# Altium project coursework_larionov.PrjPcb (part 1 of 2)
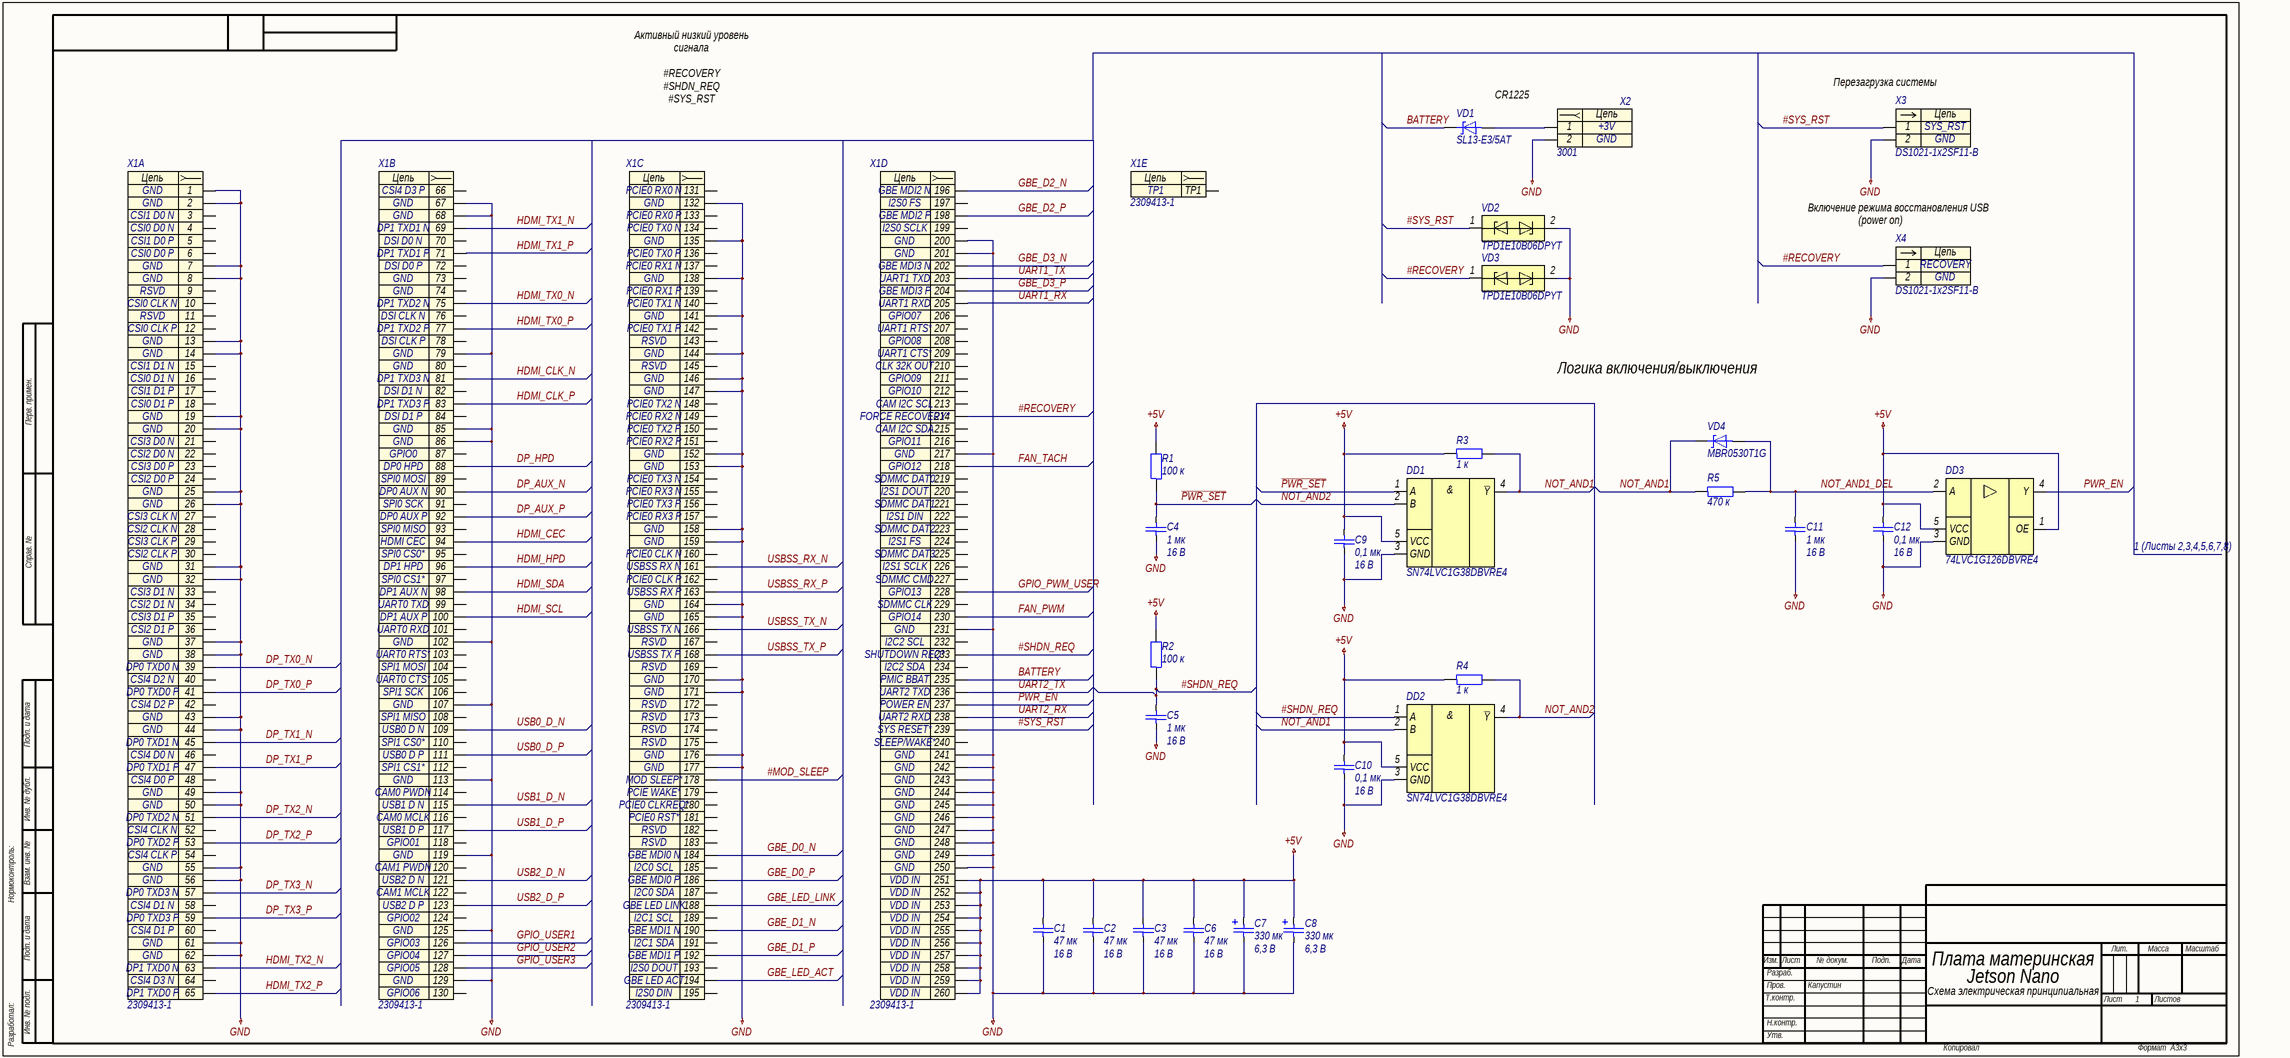
[diagram p0: 001_Jetson_Nano.SchDoc]
approver: Капустин; check: Капустин; designation: СПБПУ.3331506.016; developer: Ларионов; document_code: Ý3; document_type: Схема электрическая принципиальная; pcb_dec_number: СПБПУ.3331506.016; project: Плата материнская Jetson Nano; sheets_total: 9; title: Плата материнская Jetson Nano; title_line_1: Плата материнская; title_line_2: Jetson Nano
9 sheets, 196 parts. Net scope: global (net labels, ports and power ports of the same name join across sheets).
Sheets:
  001_Jetson_Nano.SchDoc
  002_Buck_Converter.SchDoc
  003_Serial_Port.SchDoc
  004_USB.SchDoc
  005_DP.SchDoc
  006_HDMI.SchDoc
  007_Ethernet.SchDoc
  008_Fan_GPIO_LED.SchDoc
  template_n_revision_sheet.SchDoc

## Sheet 001_Jetson_Nano.SchDoc: Плата материнская Jetson Nano
size 891 x 420 mm; ApprovedBy: Капустин; CheckedBy: Капустин; DrawnBy: Ларионов; DocumentNumber: СПБПУ.3331506.016Ý3; SheetNumber: 1; SheetTotal: 9; DocumentCode: Ý3; ImagePath: СПБПУ.3331506.016

### Parts
C1  47 мк  Напряжение: 16 В  [C1206]
C2  47 мк  Напряжение: 16 В  [C1206]
C3  47 мк  Напряжение: 16 В  [C1206]
C4  1 мк  Напряжение: 16 В  [C0603]
C5  1 мк  Напряжение: 16 В  [C0603]
C6  47 мк  Напряжение: 16 В  [C1206]
C7  330 мк  Напряжение: 6,3 В  [C7343-31]
C8  330 мк  Напряжение: 6,3 В  [C7343-31]
C9  0,1 мк  Напряжение: 16 В  [C0603]
C10  0,1 мк  Напряжение: 16 В  [C0603]
C11  1 мк  Напряжение: 16 В  [C0603]
C12  0,1 мк  Напряжение: 16 В  [C0603]
DD1  SN74LVC1G38DBVRE4  [SOT-23-5-P95-290X280X145]
DD2  SN74LVC1G38DBVRE4  [SOT-23-5-P95-290X280X145]
DD3  74LVC1G126DBVRE4  [SOT-23-5-P95-290X280X145]
R1  100 к  [R0603]
R2  100 к  [R0603]
R3  1 к  [R0603]
R4  1 к  [R0603]
R5  470 к  [R0603]
VD1  SL13-E3/5AT  [DO-214AC-510X270X229]
VD2  TPD1E10B06DPYT  [X1SON-2-100X60X45]
VD3  TPD1E10B06DPYT  [X1SON-2-100X60X45]
VD4  MBR0530T1G  [SOD-123-368X160X135]
X1  2309413-1  [2309413-1]  (parts A,B,C,D,E of 5)
X2  3001  [3001]
X3  DS1021-1x2SF11-B  [DS1021-1X2SF11-B]
X4  DS1021-1x2SF11-B  [DS1021-1X2SF11-B]

### Nets
+5V: C1.1 C2.1 C3.1 C6.1 C7.1 C8.1 C9.1 C10.1 C12.1 DD1.5(VCC) DD2.5(VCC) DD3.1(OE) DD3.5(VCC) R1.2 R2.2 R3.1 R4.1 X1.251(VDD_IN) X1.252(VDD_IN) X1.253(VDD_IN) X1.254(VDD_IN) X1.255(VDD_IN) X1.256(VDD_IN) X1.257(VDD_IN) X1.258(VDD_IN) X1.259(VDD_IN) X1.260(VDD_IN)
GND: C1.2 C2.2 C3.2 C4.2 C5.2 C6.2 C7.2 C8.2 C9.2 C10.2 C11.2 C12.2 DD1.3(GND) DD2.3(GND) DD3.3(GND) VD2.2 VD3.2 X1.1(GND) X1.2(GND) X1.7(GND) X1.8(GND) X1.13(GND) X1.14(GND) X1.19(GND) X1.20(GND) X1.25(GND) X1.26(GND) X1.31(GND) X1.32(GND) X1.37(GND) X1.38(GND) X1.43(GND) X1.44(GND) X1.49(GND) X1.50(GND) X1.55(GND) X1.56(GND) X1.61(GND) X1.62(GND) X1.67(GND) X1.68(GND) X1.79(GND) X1.85(GND) X1.86(GND) X1.102(GND) X1.107(GND) X1.113(GND) X1.119(GND) X1.125(GND) X1.129(GND) X1.132(GND) X1.135(GND) X1.138(GND) X1.141(GND) X1.144(GND) X1.146(GND) X1.147(GND) X1.152(GND) X1.153(GND) X1.158(GND) X1.159(GND) X1.164(GND) X1.165(GND) X1.170(GND) X1.171(GND) X1.176(GND) X1.177(GND) X1.200(GND) X1.201(GND) X1.217(GND) X1.231(GND) X1.241(GND) X1.242(GND) X1.243(GND) X1.244(GND) X1.245(GND) X1.246(GND) X1.247(GND) X1.248(GND) X1.249(GND) X1.250(GND) X2.2 X3.2 X4.2
#MOD_SLEEP: X1.178(MOD_SLEEP*)
#RECOVERY: VD3.1 X1.214(FORCE_RECOVERY*) X4.1
#SHDN_REQ: C5.1 DD2.1(A) R2.1 X1.233(SHUTDOWN_REQ*)
#SYS_RST: VD2.1 X1.239(SYS_RESET*) X3.1
~{PWR_SET}: C4.1 DD1.1(A) R1.1
BATTERY: VD1.1 X1.235(PMIC_BBAT)
DP_AUX_N: X1.90(DP0_AUX_N)
DP_AUX_P: X1.92(DP0_AUX_P)
DP_HPD: X1.88(DP0_HPD)
DP_TX0_N: X1.39(DP0_TXD0_N)
DP_TX0_P: X1.41(DP0_TXD0_P)
DP_TX1_N: X1.45(DP0_TXD1_N)
DP_TX1_P: X1.47(DP0_TXD1_P)
DP_TX2_N: X1.51(DP0_TXD2_N)
DP_TX2_P: X1.53(DP0_TXD2_P)
DP_TX3_N: X1.57(DP0_TXD3_N)
DP_TX3_P: X1.59(DP0_TXD3_P)
FAN_PWM: X1.230(GPIO14)
FAN_TACH: X1.218(GPIO12)
GBE_D0_N: X1.184(GBE_MDI0_N)
GBE_D0_P: X1.186(GBE_MDI0_P)
GBE_D1_N: X1.190(GBE_MDI1_N)
GBE_D1_P: X1.192(GBE_MDI1_P)
GBE_D2_N: X1.196(GBE_MDI2_N)
GBE_D2_P: X1.198(GBE_MDI2_P)
GBE_D3_N: X1.202(GBE_MDI3_N)
GBE_D3_P: X1.204(GBE_MDI3_P)
GBE_LED_ACT: X1.194(GBE_LED_ACT)
GBE_LED_LINK: X1.188(GBE_LED_LINK)
GPIO_PWM_USER: X1.228(GPIO13)
GPIO_USER1: X1.126(GPIO03)
GPIO_USER2: X1.127(GPIO04)
GPIO_USER3: X1.128(GPIO05)
HDMI_CEC: X1.94(HDMI_CEC)
HDMI_CLK_N: X1.81(DP1_TXD3_N)
HDMI_CLK_P: X1.83(DP1_TXD3_P)
HDMI_HPD: X1.96(DP1_HPD)
HDMI_SCL: X1.100(DP1_AUX_P)
HDMI_SDA: X1.98(DP1_AUX_N)
HDMI_TX0_N: X1.75(DP1_TXD2_N)
HDMI_TX0_P: X1.77(DP1_TXD2_P)
HDMI_TX1_N: X1.69(DP1_TXD1_N)
HDMI_TX1_P: X1.71(DP1_TXD1_P)
HDMI_TX2_N: X1.63(DP1_TXD0_N)
HDMI_TX2_P: X1.65(DP1_TXD0_P)
NOT_AND1: DD1.4(~{Y}) DD2.2(B) R3.2 R5.1 VD4.1
NOT_AND1_DEL: C11.1 DD3.2(A) R5.2 VD4.2
NOT_AND2: DD1.2(B) DD2.4(~{Y}) R4.2
PWR_EN: DD3.4(Y) X1.237(POWER_EN)
UART1_RX: X1.205(UART1_RXD)
UART1_TX: X1.203(UART1_TXD)
UART2_RX: X1.238(UART2_RXD)
UART2_TX: X1.236(UART2_TXD)
USB0_D_N: X1.109(USB0_D_N)
USB0_D_P: X1.111(USB0_D_P)
USB1_D_N: X1.115(USB1_D_N)
USB1_D_P: X1.117(USB1_D_P)
USB2_D_N: X1.121(USB2_D_N)
USB2_D_P: X1.123(USB2_D_P)
USBSS_RX_N: X1.161(USBSS_RX_N)
USBSS_RX_P: X1.163(USBSS_RX_P)
USBSS_TX_N: X1.166(USBSS_TX_N)
USBSS_TX_P: X1.168(USBSS_TX_P)
NetVD1_2: VD1.2 X2.1

Not connected (* = marked no-connect by the designer): X1 3(CSI1_D0_N) 4(CSI0_D0_N) 5(CSI1_D0_P) 6(CSI0_D0_P) 9(RSVD) 10(CSI0_CLK_N) 11(RSVD) 12(CSI0_CLK_P) 15(CSI1_D1_N) 16(CSI0_D1_N) 17(CSI1_D1_P) 18(CSI0_D1_P) 21(CSI3_D0_N) 22(CSI2_D0_N) 23(CSI3_D0_P) 24(CSI2_D0_P) 27(CSI3_CLK_N) 28(CSI2_CLK_N) 29(CSI3_CLK_P) 30(CSI2_CLK_P) 33(CSI3_D1_N) 34(CSI2_D1_N) 35(CSI3_D1_P) 36(CSI2_D1_P) 40(CSI4_D2_N) 42(CSI4_D2_P) 46(CSI4_D0_N) 48(CSI4_D0_P) 52(CSI4_CLK_N) 54(CSI4_CLK_P) 58(CSI4_D1_N) 60(CSI4_D1_P) 64(CSI4_D3_N) 66(CSI4_D3_P) 70(DSI_D0_N) 72(DSI_D0_P) 73(GND) 74(GND) 76(DSI_CLK_N) 78(DSI_CLK_P) 80(GND) 82(DSI_D1_N) 84(DSI_D1_P) 87(GPIO0) 89(SPI0_MOSI) 91(SPI0_SCK) 93(SPI0_MISO) 95(SPI0_CS0*) 97(SPI0_CS1*) 99(UART0_TXD) 101(UART0_RXD) 103(UART0_RTS*) 104(SPI1_MOSI) 105(UART0_CTS*) 106(SPI1_SCK) 108(SPI1_MISO) 110(SPI1_CS0*) 112(SPI1_CS1*) 114(CAM0_PWDN) 116(CAM0_MCLK) 118(GPIO01) 120(CAM1_PWDN) 122(CAM1_MCLK) 124(GPIO02) 130(GPIO06) 131(PCIE0_RX0_N) 133(PCIE0_RX0_P) 134(PCIE0_TX0_N) 136(PCIE0_TX0_P) 137(PCIE0_RX1_N) 139(PCIE0_RX1_P) 140(PCIE0_TX1_N) 142(PCIE0_TX1_P) 143(RSVD) 145(RSVD) 148(PCIE0_TX2_N) 149(PCIE0_RX2_N) 150(PCIE0_TX2_P) 151(PCIE0_RX2_P) 154(PCIE0_TX3_N) 155(PCIE0_RX3_N) 156(PCIE0_TX3_P) 157(PCIE0_RX3_P) 160(PCIE0_CLK_N) 162(PCIE0_CLK_P) 167(RSVD) 169(RSVD) 172(RSVD) 173(RSVD) 174(RSVD) 175(RSVD) 179(PCIE_WAKE*) 180(PCIE0_CLKREQ*) 181(PCIE0_RST*) 182(RSVD) 183(RSVD) 185(I2C0_SCL) 187(I2C0_SDA) 189(I2C1_SCL) 191(I2C1_SDA) 193(I2S0_DOUT) 195(I2S0_DIN) 197(I2S0_FS) 199(I2S0_SCLK) 206(GPIO07) 207(UART1_RTS*) 208(GPIO08) 209(UART1_CTS*) 210(CLK_32K_OUT) 211(GPIO09) 212(GPIO10) 213(CAM_I2C_SCL) 215(CAM_I2C_SDA) 216(GPIO11) 219(SDMMC_DAT0) 220(I2S1_DOUT) 221(SDMMC_DAT1) 222(I2S1_DIN) 223(SDMMC_DAT2) 224(I2S1_FS) 225(SDMMC_DAT3) 226(I2S1_SCLK) 227(SDMMC_CMD) 229(SDMMC_CLK) 232(I2C2_SCL) 234(I2C2_SDA) 240(SLEEP/WAKE*) TP1

### Notes on the sheet
- Активный низкий уровень сигнала
  #RECOVERY
  #SHDN_REQ
  #SYS_RST
  #MOD_SLEEP
- CR1225
- Перезагрузка системы
- Включение режима восстановления USB
- (power on)
- Логика включения/выключения
- 1 (Листы 2,3,4,5,6,7,8)
- Перв. примен.
- Справ. №
- Подп. и дата
- Инв. № дубл.
- Нормоконтроль:
- Взам. инв. №
- Изм.
- Лист
- № докум.
- Подп.
- Дата
- Лит.
- Масса
- Масштаб
- Т.контр.
- Пров.
- Разраб.
- Листов
- Разработал:
- Инв. № подл.
- Н.контр.
- Утв.
- Копировал
- Формат
- А3х3
- (in symbol dd0001) &
- (in symbol x0017, part A) Цепь
- (in symbol x0017, part B) Цепь
- (in symbol x0017, part C) Цепь
- (in symbol x0017, part D) Цепь
- (in symbol x0017, part E) Цепь
- (in symbol x0025) Цепь
- (in symbol x0058) Цепь

### Library data of the parts
C1-C3 C6 = c0168: =Описание; ID: c0168; Фамилия: Паньков; Описание: Конденсатор керамический чип 1206 47 мкФ 16 В ±20 %; Наименование: CC1206MKX5R7BB476; Производитель: YAGEO Corp.; Отклонение: ±20 %; Рабочие температуры: от –55 °С до +85 °С; Температурный коэффициент емкости: X5R; Корпус: 1206; Номинал: 47 мк; Номинальное напряжение: 16 В; HelpURL: https://www.yageo.com/upload/media/product/productsearch/datasheet/mlcc/UPY-GPHC_X5R_4V-to-50V_26.pdf
C4 C5 C11 = c0113: =Описание; ID: c0113; Фамилия: Паньков; Описание: Конденсатор керамический чип 0603 1 мкФ 16 В ±10 %; Наименование: CC0603KRX7R7BB105; Производитель: YAGEO Corp.; Отклонение: ±10 %; Рабочие температуры: от –55 °С до +125 °С; Температурный коэффициент емкости: X7R; Корпус: 0603; Номинал: 1 мк; Номинальное напряжение: 16 В; HelpURL: https://www.yageo.com/upload/media/product/productsearch/datasheet/mlcc/UPY-GPHC_X7R_6.3V-to-50V_20.pdf
C7 C8 = c0173: =Описание; ID: c0173; Фамилия: Ларионов; Описание: Конденсатор электролитический чип 7343-31 330 мкФ 6,3 В ±20 %; Наименование: ECASD60J337M009KA0; Производитель: Murata Manufacturing Co., Ltd.; Отклонение: ±20 %; Эквивалентное последовательное сопротивление: 0,009 Ом; Среднеквадратичный размах пульсации тока: 3,5 А; Рабочие температуры: от –40 °С до +105 °С; Корпус: 7343-31; Номинал: 330 мк; Номинальное напряжение: 6,3 В; HelpURL: https://www.murata.com/en-us/products/productdetail?partno=ECASD60J337M009KA0
C9 C10 C12 = c0081: =Описание; ID: c0081; Фамилия: Паньков; Описание: Конденсатор керамический чип 0603 100 нФ 16 В ±10 %; Наименование: CC0603KRX7R7BB104; Производитель: YAGEO Corp.; Отклонение: ±10 %; Рабочие температуры: от –55 °С до +125 °С; Температурный коэффициент емкости: X7R; Корпус: 0603; Номинал: 0,1 мк; Номинальное напряжение: 16 В; HelpURL: https://www.yageo.com/upload/media/product/productsearch/datasheet/mlcc/UPY-GPHC_X7R_6.3V-to-50V_20.pdf
DD1 DD2 = dd0001: =Описание; ID: dd0001; Фамилия: Ларионов; Описание: Логический элемент И-НЕ 2 входа 1 выход; Производитель: Texas Instruments Inc.; Корпус: SOT-23-5; Наименование: SN74LVC1G38DBVRE4; HelpURL: https://www.ti.com/product/SN74LVC1G38
DD3 = dd0001: =Описание; ID: dd0001; Фамилия: Ларионов; Описание: Буферная микросхема 1 линия 3 состояния выхода; Производитель: Texas Instruments Inc.; Корпус: SOT-23-5; Наименование: 74LVC1G126DBVRE4; HelpURL: https://www.ti.com/product/SN74LVC1G126
R1 R2 = r0141: =Описание; ID: r0141; Фамилия: Водорезов; Описание: Резистор чип 0603 100 кОм ±1 % 0,1 Вт; Наименование: RC0603FR-07100KL; Производитель: YAGEO Corp.; Отклонение: ±1 %; Номинальное напряжение: 75 В; Номинальный ток: 1 А; Рабочие температуры: от –55 °С до +155 °С; Корпус: 0603; Примечание: Ряд E24; Номинал: 100 к; HelpURL: https://www.yageo.com/upload/media/product/productsearch/datasheet/rchip/PYu-RC_Group_51_RoHS_L_11.pdf
R3 R4 = r0076: =Описание; ID: r0076; Фамилия: Ларионов; Описание: Резистор чип 0603 1 кОм ±1 % 0,1 Вт; Наименование: RC0603FR-071KL; Производитель: YAGEO Corp.; Отклонение: ±1 %; Номинальное напряжение: 75 В; Номинальный ток: 1 А; Рабочие температуры: от –55 °С до +155 °С; Корпус: 0603; Примечание: Ряд E24; Номинал: 1 к; HelpURL: https://www.yageo.com/upload/media/product/productsearch/datasheet/rchip/PYu-RC_Group_51_RoHS_L_11.pdf
R5 = r0164: =Описание; ID: r0164; Фамилия: Паньков; Описание: Резистор чип 0603 470 кОм ±1 % 0,1 Вт; Наименование: RC0603FR-07470KL; Производитель: YAGEO Corp.; Отклонение: ±1 %; Номинальное напряжение: 75 В; Номинальный ток: 1 А; Рабочие температуры: от –55 °С до +155 °С; Корпус: 0603; Примечание: Ряд E24; Номинал: 470 к; HelpURL: https://www.yageo.com/upload/media/product/productsearch/datasheet/rchip/PYu-RC_Group_51_RoHS_L_11.pdf
VD1 = vd0003: =Описание; ID: vd0003; Фамилия: Ларионов; Описание: Диод Шоттки 30 В 1,5 А; Производитель: Vishay Intertechnology, Inc.; Максимальное прямое напряжение: 0,445 В; Максимальное обратное напряжение: 30 В; Максимальный прямой ток: 1,5 А; Рабочие температуры: от –55 °С до +125 °С; Корпус: DO-214AC; Наименование: SL13-E3/5AT; HelpURL: https://www.vishay.com/product?docid=88740
VD2 VD3 = vd0013: =Описание; ID: vd0013; Фамилия: Ларионов; Описание: Двунаправленная диодная сборка для подавления помех 5,5 В; Производитель: Texas Instruments Inc.; Корпус: X1SON-2; Наименование: TPD1E10B06DPYT; HelpURL: https://www.ti.com/product/TPD1E10B06
VD4 = vd0001: =Описание; ID: vd0001; Фамилия: Шкабара; Описание: Диод Шоттки 30 В 0,5 А; Производитель: ON Semiconductor; Максимальное прямое напряжение: 0,43 В; Максимальное обратное напряжение: 30 В; Максимальный прямой ток: 0,5 А; Рабочие температуры: от –65 °С до +125 °С; Корпус: SOD-123; Наименование: MBR0530T1G; HelpURL: https://www.onsemi.com/products/discretes-drivers/diodes-rectifiers/schottky-diodes-schottky-rectifiers/mbr0530t1g
X1 = x0017: =Описание; Contact_001: GND; Contact_003: CSI1 D0 N; Contact_004: CSI0 D0 N; Contact_005: CSI1 D0 P; Contact_006: CSI0 D0 P; Contact_010: CSI0 CLK N; Contact_011: RSVD; Contact_012: CSI0 CLK P; Contact_015: CSI1 D1 N; Contact_016: CSI0 D1 N; Contact_017: CSI1 D1 P; Contact_030: CSI2 CLK P; Contact_036: CSI2 D1 P; Contact_039: DP0 TXD0 N; Contact_040: CSI4 D2 N; Contact_018: CSI0 D1 P; Contact_021: CSI3 D0 N; Contact_022: CSI2 D0 N; Contact_023: CSI3 D0 P; Contact_024: CSI2 D0 P; Contact_027: CSI3 CLK N; Contact_028: CSI2 CLK N; Contact_029: CSI3 CLK P; Contact_033: CSI3 D1 N; Contact_034: CSI2 D1 N; Contact_035: CSI3 D1 P; Contact_041: DP0 TXD0 P; Contact_052: CSI4 CLK N; Contact_063: DP1 TXD0 N; Contact_069: DP1 TXD1 N; Contact_070: DSI D0 N; Contact_071: DP1 TXD1 P; Contact_072: DSI D0 P; Contact_042: CSI4 D2 P; Contact_045: DP0 TXD1 N; Contact_046: CSI4 D0 N; Contact_047: DP0 TXD1 P; Contact_048: CSI4 D0 P; Contact_051: DP0 TXD2 N; Contact_053: DP0 TXD2 P; Contact_054: CSI4 CLK P; Contact_057: DP0 TXD3 N; Contact_058: CSI4 D1 N; Contact_059: DP0 TXD3 P; Contact_060: CSI4 D1 P; Contact_064: CSI4 D3 N; Contact_065: DP1 TXD0 P; Contact_066: CSI4 D3 P; Contact_075: DP1 TXD2 N; Contact_076: DSI CLK N; Contact_077: DP1 TXD2 P; Contact_078: DSI CLK P; Contact_081: DP1 TXD3 N; Contact_082: DSI D1 N; Contact_083: DP1 TXD3 P; Contact_084: DSI D1 P; Contact_087: GPIO0; Contact_088: DP0 HPD; Contact_089: SPI0 MOSI; Contact_090: DP0 AUX N; Contact_091: SPI0 SCK; Contact_092: DP0 AUX P; Contact_093: SPI0 MISO; Contact_094: HDMI CEC; Contact_095: SPI0 CS0*; Contact_096: DP1 HPD; Contact_097: SPI0 CS1*; Contact_098: DP1 AUX N; Contact_099: UART0 TXD; Contact_100: DP1 AUX P; Contact_101: UART0 RXD; Contact_103: UART0 RTS*; Contact_104: SPI1 MOSI; Contact_105: UART0 CTS*; Contact_106: SPI1 SCK; Contact_108: SPI1 MISO; Contact_109: USB0 D N; Contact_110: SPI1 CS0*; Contact_111: USB0 D P; Contact_112: SPI1 CS1*; Contact_114: CAM0 PWDN; Contact_115: USB1 D N; Contact_116: CAM0 MCLK; Contact_117: USB1 D P; Contact_118: GPIO01; Contact_120: CAM1 PWDN; Contact_121: USB2 D N; Contact_122: CAM1 MCLK; Contact_123: USB2 D P; Contact_124: GPIO02; Contact_126: GPIO03; Contact_127: GPIO04; Contact_128: GPIO05; Contact_130: GPIO06; Contact_131: PCIE0 RX0 N; Contact_133: PCIE0 RX0 P; Contact_134: PCIE0 TX0 N; Contact_136: PCIE0 TX0 P; Contact_137: PCIE0 RX1 N; Contact_139: PCIE0 RX1 P; Contact_140: PCIE0 TX1 N; Contact_142: PCIE0 TX1 P; Contact_148: PCIE0 TX2 N; Contact_149: PCIE0 RX2 N; Contact_150: PCIE0 TX2 P; Contact_151: PCIE0 RX2 P; Contact_154: PCIE0 TX3 N; Contact_155: PCIE0 RX3 N; Contact_156: PCIE0 TX3 P; Contact_157: PCIE0 RX3 P; Contact_160: PCIE0 CLK N; Contact_161: USBSS RX N; Contact_162: PCIE0 CLK P; Contact_163: USBSS RX P; Contact_166: USBSS TX N; Contact_168: USBSS TX P; Contact_178: MOD SLEEP*; Contact_179: PCIE WAKE*; Contact_180: PCIE0 CLKREQ*; Contact_181: PCIE0 RST*; Contact_184: GBE MDI0 N; Contact_185: I2C0 SCL; Contact_186: GBE MDI0 P; Contact_187: I2C0 SDA; Contact_188: GBE LED LINK; Contact_189: I2C1 SCL; Contact_190: GBE MDI1 N; Contact_191: I2C1 SDA; Contact_192: GBE MDI1 P; Contact_193: I2S0 DOUT; Contact_194: GBE LED ACT; Contact_195: I2S0 DIN; Contact_196: GBE MDI2 N; Contact_197: I2S0 FS; Contact_198: GBE MDI2 P; Contact_199: I2S0 SCLK; Contact_202: GBE MDI3 N; Contact_203: UART1 TXD; Contact_204: GBE MDI3 P; Contact_205: UART1 RXD; Contact_206: GPIO07; Contact_207: UART1 RTS*; Contact_208: GPIO08; Contact_209: UART1 CTS*; Contact_210: CLK 32K OUT; Contact_211: GPIO09; Contact_212: GPIO10; Contact_213: CAM I2C SCL; Contact_214: FORCE RECOVERY*; Contact_215: CAM I2C SDA; Contact_216: GPIO11; Contact_218: GPIO12; Contact_219: SDMMC DAT0; Contact_220: I2S1 DOUT; Contact_221: SDMMC DAT1; Contact_222: I2S1 DIN; Contact_223: SDMMC DAT2; Contact_224: I2S1 FS; Contact_225: SDMMC DAT3; Contact_226: I2S1 SCLK; Contact_227: SDMMC CMD; Contact_228: GPIO13; Contact_229: SDMMC CLK; Contact_230: GPIO14; Contact_232: I2C2 SCL; Contact_233: SHUTDOWN REQ*; Contact_234: I2C2 SDA; Contact_235: PMIC BBAT; Contact_236: UART2 TXD; Contact_237: POWER EN; Contact_238: UART2 RXD; Contact_239: SYS RESET*; Contact_240: SLEEP/WAKE*; Contact_251: VDD IN; ID: x0017; Фамилия: Ларионов; Описание: SO DIMM 260 pin высота 9,2 мм гнездо угловой; Производитель: TE Connectivity; Contact_002: GND; Contact_007: GND; Contact_008: GND; Contact_013: GND; Contact_014: GND; Contact_009: RSVD; Contact_019: GND; Contact_037: GND; Contact_038: GND; Contact_020: GND; Contact_025: GND; Contact_026: GND; Contact_031: GND; Contact_032: GND; Contact_067: GND; Contact_068: GND; Contact_043: GND; Contact_044: GND; Contact_049: GND; Contact_050: GND; Contact_055: GND; Contact_056: GND; Contact_061: GND; Contact_062: GND; Contact_073: GND; Contact_074: GND; Contact_079: GND; Contact_080: GND; Contact_085: GND; Contact_086: GND; Contact_102: GND; Contact_107: GND; Contact_113: GND; Contact_119: GND; Contact_125: GND; Contact_129: GND; Contact_132: GND; Contact_135: GND; Contact_138: GND; Contact_141: GND; Contact_143: RSVD; Contact_144: GND; Contact_145: RSVD; Contact_146: GND; Contact_147: GND; Contact_152: GND; Contact_153: GND; Contact_158: GND; Contact_159: GND; Contact_164: GND; Contact_165: GND; Contact_167: RSVD; Contact_169: RSVD; Contact_170: GND; Contact_171: GND; Contact_172: RSVD; Contact_173: RSVD; Contact_174: RSVD; Contact_175: RSVD; Contact_176: GND; Contact_177: GND; Contact_182: RSVD; Contact_183: RSVD; Contact_200: GND; Contact_201: GND; Contact_217: GND; Contact_231: GND; Contact_241: GND; Contact_242: GND; Contact_243: GND; Contact_244: GND; Contact_245: GND; Contact_246: GND; Contact_247: GND; Contact_248: GND; Contact_249: GND; Contact_250: GND; Contact_252: VDD IN; Contact_253: VDD IN; Contact_254: VDD IN; Contact_255: VDD IN; Contact_256: VDD IN; Contact_257: VDD IN; Contact_258: VDD IN; Contact_259: VDD IN; Contact_260: VDD IN; TP1: TP1; Наименование: 2309413-1; HelpURL: https://www.te.com/usa-en/product-2309413-1.html
X2 = x0058: =Описание; Contact_1: +3V; Contact_2: GND; ID: x0058; Фамилия: Ларионов; Описание: Battery Holder CR1225 2 pin гнездо; Производитель: Keystone Electronics Corp.; Наименование: 3001; HelpURL: https://www.keyelco.com/product.cfm/product_id/778
X3 = x0025: =Описание; Contact_1: SYS_RST; Contact_2: GND; ID: x0025; Фамилия: Паньков; Описание: PLS 2 pin 2,54 мм вилка прямой; Производитель: Connfly Electronic Co., Ltd.; Наименование: DS1021-1x2SF11-B; HelpURL: http://en.connfly.group/product/xVkr=EusQssAN0gN=Aos=mU+UrVkR9kqEAN0gN9g+WqANB+A
X4 = x0025: =Описание; Contact_1: RECOVERY; Contact_2: GND; ID: x0025; Фамилия: Паньков; Описание: PLS 2 pin 2,54 мм вилка прямой; Производитель: Connfly Electronic Co., Ltd.; Наименование: DS1021-1x2SF11-B; HelpURL: http://en.connfly.group/product/xVkr=EusQssAN0gN=Aos=mU+UrVkR9kqEAN0gN9g+WqANB+A

## Sheet 002_Buck_Converter.SchDoc: Плата материнская Jetson Nano
size 594 x 420 mm; ApprovedBy: Капустин; CheckedBy: Капустин; DrawnBy: Ларионов; DocumentNumber: СПБПУ.3331506.016Ý3; SheetNumber: 2; SheetTotal: 9; DocumentCode: Ý3; ImagePath: СПБПУ.3331506.016
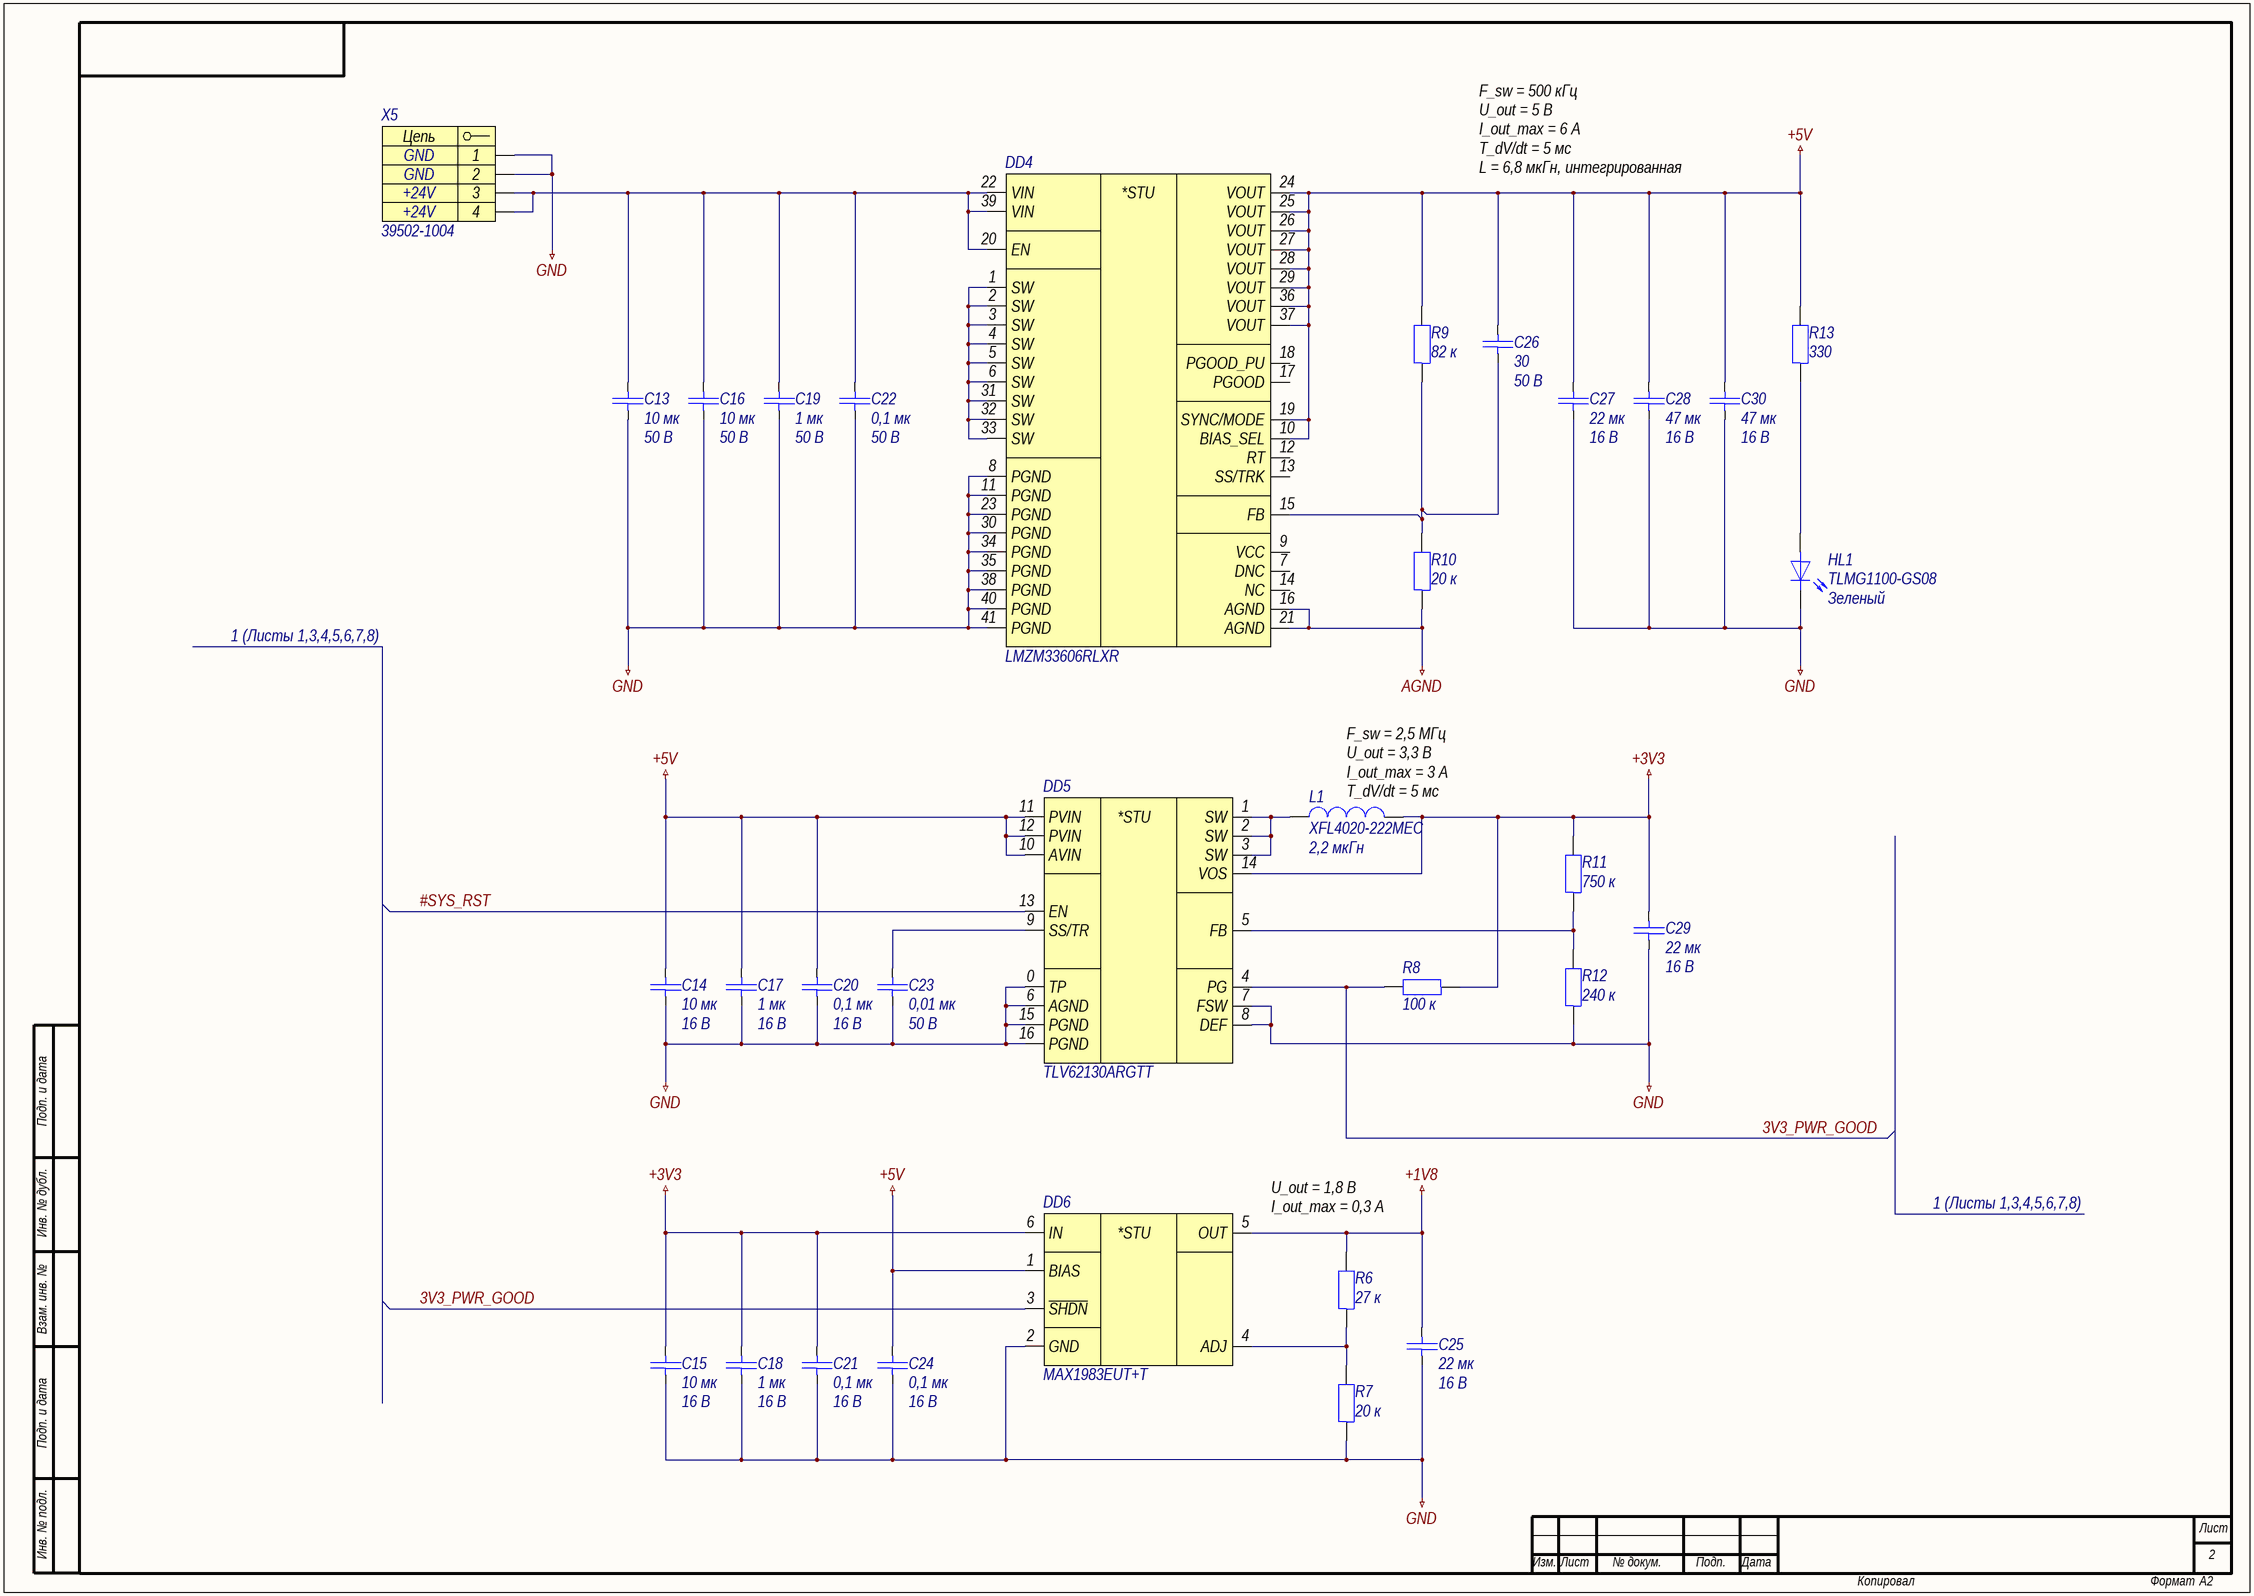
[diagram p1: 002_Buck_Converter.SchDoc]

### Parts
C13  10 мк  Напряжение: 50 В  [C0805]
C14  10 мк  Напряжение: 16 В  [C0603]
C15  10 мк  Напряжение: 16 В  [C0603]
C16  10 мк  Напряжение: 50 В  [C0805]
C17  1 мк  Напряжение: 16 В  [C0603]
C18  1 мк  Напряжение: 16 В  [C0603]
C19  1 мк  Напряжение: 50 В  [C0603]
C20  0,1 мк  Напряжение: 16 В  [C0603]
C21  0,1 мк  Напряжение: 16 В  [C0603]
C22  0,1 мк  Напряжение: 50 В  [C0603]
C23  0,01 мк  Напряжение: 50 В  [C0603]
C24  0,1 мк  Напряжение: 16 В  [C0603]
C25  22 мк  Напряжение: 16 В  [C0805]
C26  30  Напряжение: 50 В  [C0603]
C27  22 мк  Напряжение: 16 В  [C0805]
C28  47 мк  Напряжение: 16 В  [C1206]
C29  22 мк  Напряжение: 16 В  [C0805]
C30  47 мк  Напряжение: 16 В  [C1206]
DD4  LMZM33606RLXR  [B2QFN-41-1600X1000X410]
DD5  TLV62130ARGTT  [WQFN-16-P50-300X300X100-L40X24-T168X168]
DD6  MAX1983EUT+T  [SOT-23-6-P95-290X280X145]
HL1  TLMG1100-GS08  Цвет: Зеленый  [HL0603]
L1  XFL4020-222MEC  Индуктивность: 2,2 мкГн  [XFL-2-400X400X210]
R6  27 к  [R0603]
R7  20 к  [R0603]
R8  100 к  [R0603]
R9  82 к  [R0603]
R10  20 к  [R0603]
R11  750 к  [R0603]
R12  240 к  [R0603]
R13  330  [R0603]
X5  39502-1004  [39502-1004]

### Nets
+1V8: C25.1 DD6.5(OUT) R6.2
+3V3: C15.1 C18.1 C21.1 C29.1 DD5.14(VOS) DD6.6(IN) L1.2 R8.1 R11.2
+5V: C14.1 C17.1 C20.1 C24.1 C26.1 C27.1 C28.1 C30.1 DD4.10(BIAS_SEL) DD4.19(SYNC/MODE) DD4.24(VOUT) DD4.25(VOUT) DD4.26(VOUT) DD4.27(VOUT) DD4.28(VOUT) DD4.29(VOUT) DD4.36(VOUT) DD4.37(VOUT) DD5.10(AVIN) DD5.11(PVIN) DD5.12(PVIN) DD6.1(BIAS) R9.2 R13.2
AGND: DD4.16(AGND) DD4.21(AGND) R10.1
GND: C13.2 C14.2 C15.2 C16.2 C17.2 C18.2 C19.2 C20.2 C21.2 C22.2 C23.2 C24.2 C25.2 C27.2 C28.2 C29.2 C30.2 DD4.8(PGND) DD4.11(PGND) DD4.23(PGND) DD4.30(PGND) DD4.34(PGND) DD4.35(PGND) DD4.38(PGND) DD4.40(PGND) DD4.41(PGND) DD5.0(TP) DD5.6(AGND) DD5.7(FSW) DD5.8(DEF) DD5.15(PGND) DD5.16(PGND) DD6.2(GND) HL1.1 R7.1 R12.1 X5.1 X5.2
3V3_PWR_GOOD: DD5.4(PG) DD6.3(~{SHDN}) R8.2
#SYS_RST: DD5.13(EN)
NetC13_1: C13.1 C16.1 C19.1 C22.1 DD4.20(EN) DD4.22(VIN) DD4.39(VIN) X5.3 X5.4
NetC23_1: C23.1 DD5.9(SS/TR)
NetC26_2: C26.2 DD4.15(FB) R9.1 R10.2
NetDD4_1: DD4.1(SW) DD4.2(SW) DD4.3(SW) DD4.4(SW) DD4.5(SW) DD4.6(SW) DD4.31(SW) DD4.32(SW) DD4.33(SW)
NetDD5_1: DD5.1(SW) DD5.2(SW) DD5.3(SW) L1.1
NetDD5_5: DD5.5(FB) R11.1 R12.2
NetDD6_4: DD6.4(ADJ) R6.1 R7.2
NetHL1_2: HL1.2 R13.1

Not connected (* = marked no-connect by the designer): DD4 7(DNC) 9(VCC) 12(RT) 13(SS/TRK) 14(NC) 17(PGOOD) 18(PGOOD_PU)

### Notes on the sheet
- F_sw = 500 кГц
  U_out = 5 В
  I_out_max = 6 А
  T_dV/dt = 5 мс
  L = 6,8 мкГн, интегрированная
- 1 (Листы 1,3,4,5,6,7,8)
- (near L1) F_sw = 2,5 МГц
  U_out = 3,3 В
  I_out_max = 3 А
  T_dV/dt = 5 мс
- U_out = 1,8 В
  I_out_max = 0,3 А
- Подп. и дата
- Инв. № дубл.
- Взам. инв. №
- Инв. № подл.
- Лист
- Изм.
- № докум.
- Подп.
- Дата
- Копировал
- Формат
- А2
- (in symbol dd0001) *STU
- (in symbol dd0016) *STU
- (in symbol dd0017) *STU
- (in symbol x0051) Цепь

### Library data of the parts
C13 C16 = c0149: =Описание; ID: c0149; Фамилия: Паньков; Описание: Конденсатор керамический чип 0805 10 мкФ 50 В ±10 %; Наименование: CC0805KKX5R9BB106; Производитель: YAGEO Corp.; Отклонение: ±10 %; Рабочие температуры: от –55 °С до +85 °С; Температурный коэффициент емкости: X5R; Корпус: 0805; Номинал: 10 мк; Номинальное напряжение: 50 В; HelpURL: https://www.yageo.com/upload/media/product/productsearch/datasheet/mlcc/UPY-GPHC_X5R_4V-to-50V_26.pdf
C14 C15 = c0145: =Описание; ID: c0145; Фамилия: Паньков; Описание: Конденсатор керамический чип 0603 10 мкФ 16 В ±10 %; Наименование: CC0603KRX5R7BB106; Производитель: YAGEO Corp.; Отклонение: ±10 %; Рабочие температуры: от –55 °С до +85 °С; Температурный коэффициент емкости: X5R; Корпус: 0603; Номинал: 10 мк; Номинальное напряжение: 16 В; HelpURL: https://www.yageo.com/upload/media/product/productsearch/datasheet/mlcc/UPY-GPHC_X5R_4V-to-50V_26.pdf
C17 C18 = c0113: as C4 on sheet 001_Jetson_Nano; Номинал: 1 мк; Номинальное напряжение: 16 В; HelpURL: https://www.yageo.com/upload/media/product/productsearch/datasheet/mlcc/UPY-GPHC_X7R_6.3V-to-50V_20.pdf
C19 = c0117: =Описание; ID: c0117; Фамилия: Паньков; Описание: Конденсатор керамический чип 0603 1 мкФ 50 В ±10 %; Наименование: CC0603KRX7R9BB105; Производитель: YAGEO Corp.; Отклонение: ±10 %; Рабочие температуры: от –55 °С до +125 °С; Температурный коэффициент емкости: X7R; Корпус: 0603; Номинал: 1 мк; Номинальное напряжение: 50 В; HelpURL: https://www.yageo.com/upload/media/product/productsearch/datasheet/mlcc/UPY-GPHC_X7R_6.3V-to-50V_20.pdf
C20 C21 C24 = c0081: as C9 on sheet 001_Jetson_Nano; Номинал: 0,1 мк; Номинальное напряжение: 16 В; HelpURL: https://www.yageo.com/upload/media/product/productsearch/datasheet/mlcc/UPY-GPHC_X7R_6.3V-to-50V_20.pdf
C22 = c0086: =Описание; ID: c0086; Фамилия: Паньков; Описание: Конденсатор керамический чип 0603 100 нФ 50 В ±10 %; Наименование: CC0603KRX7R9BB104; Производитель: YAGEO Corp.; Отклонение: ±10 %; Рабочие температуры: от –55 °С до +125 °С; Температурный коэффициент емкости: X7R; Корпус: 0603; Номинал: 0,1 мк; Номинальное напряжение: 50 В; HelpURL: https://www.yageo.com/upload/media/product/productsearch/datasheet/mlcc/UPY-GPHC_X7R_6.3V-to-50V_20.pdf
C23 = c0056: =Описание; ID: c0056; Фамилия: Паньков; Описание: Конденсатор керамический чип 0603 10 нФ 50 В ±10 %; Наименование: CC0603KRX7R9BB103; Производитель: YAGEO Corp.; Отклонение: ±10 %; Рабочие температуры: от –55 °С до +125 °С; Температурный коэффициент емкости: X7R; Корпус: 0603; Номинал: 0,01 мк; Номинальное напряжение: 50 В; HelpURL: https://www.yageo.com/upload/media/product/productsearch/datasheet/mlcc/UPY-GPHC_X7R_6.3V-to-50V_20.pdf
C25 C27 C29 = c0159: =Описание; ID: c0159; Фамилия: Паньков; Описание: Конденсатор керамический чип 0805 22 мкФ 16 В ±20 %; Наименование: CC0805MRX5R7BB226; Производитель: YAGEO Corp.; Отклонение: ±20 %; Рабочие температуры: от –55 °С до +85 °С; Температурный коэффициент емкости: X5R; Корпус: 0805; Номинал: 22 мк; Номинальное напряжение: 16 В; HelpURL: https://www.yageo.com/upload/media/product/productsearch/datasheet/mlcc/UPY-GPHC_X5R_4V-to-50V_26.pdf
C26 = c0022: =Описание; ID: c0022; Фамилия: Ларионов; Описание: Конденсатор керамический чип 0603 30 пФ 50 В ±5 %; Наименование: CC0603JRNPO9BN300; Производитель: YAGEO Corp.; Отклонение: ±5 %; Рабочие температуры: от –55 °С до +125 °С; Температурный коэффициент емкости: C0G; Корпус: 0603; Номинал: 30; Номинальное напряжение: 50 В; HelpURL: https://www.yageo.com/upload/media/product/productsearch/datasheet/mlcc/UPY-GP_NP0_16V-to-50V_18.pdf
C28 C30 = c0168: as C1 on sheet 001_Jetson_Nano; Номинал: 47 мк; Номинальное напряжение: 16 В; HelpURL: https://www.yageo.com/upload/media/product/productsearch/datasheet/mlcc/UPY-GPHC_X5R_4V-to-50V_26.pdf
DD4 = dd0016: =Описание; ID: dd0016; Фамилия: Ларионов; Описание: Понижающий преобразователь напряжения 3,5…36 В / 1,0…20 В и 6 А; Производитель: Texas Instruments Inc.; Входное напряжение: от 3,5 В до 36 В; Выходное напряжение: от 1,0 В до 20 В; Коммутируемый ток: до 6,0 А; Частота переключения: от 350 кГц до 2,2 МГц; Рабочие температуры: от –40 °С до +125 °С; Корпус: B2QFN-41; Наименование: LMZM33606RLXR; HelpURL: https://www.ti.com/product/LMZM33606
DD5 = dd0017: =Описание; ID: dd0017; Фамилия: Самарин; Описание: Понижающий преобразователь напряжения 3,0…17 В / 0,9…5,25 В и 3,0 А; Производитель: Texas Instruments Inc.; Входное напряжение: от 3,0 В до 17 В; Выходное напряжение: от 0,9 до 5,25 В; Коммутируемый ток: до 3,0 А; Частота переключения: от 1,25 МГц до 2,5 МГц; Рабочие температуры: от –40 °С до +85 °С; Корпус: WQFN-16; Наименование: TLV62130ARGTT; HelpURL: https://www.ti.com/product/TLV62130
DD6 = dd0001: =Описание; ID: dd0001; Фамилия: Ларионов; Описание: Линейный стабилизатор напряжения 1,25…5,5 В / 0,8…2,0 В и 0,3 А; Производитель: Maxim Integrated Products, Inc.; Входное напряжение: от 1,25 В до 5,5 В; Выходное напряжение: от 0,8 В до 2,0 В; Коммутируемый ток: до 0,3 А; Частота переключения: —; Рабочие температуры: от –40 °С до +85 °С; Корпус: SOT-23-6; Наименование: MAX1983EUT+T; HelpURL: https://www.maximintegrated.com/en/products/power/linear-regulators/MAX1983.html
HL1 = hl0005: =Описание; ID: hl0005; Фамилия: Ларионов; Описание: Светодиод чип 0603 зеленый; Производитель: Vishay Intertechnology, Inc.; Номинальная сила света: 35 мкд; Номинальная длина волны: 570 нм; Номинальный прямой ток: 30 мА; Номинальное падение напряжения: 2,1 В; Рассеиваемая мощность: 90 мВт; Рабочие температуры: от –40 °С до +100 °С; Корпус: 0603; Наименование: TLMG1100-GS08; HelpURL: https://www.vishay.com/leds/list/product-83173/
L1 = l0002: =Описание; ID: l0002; Фамилия: Ларионов; Описание: Катушка индуктивности 2,2 мкГн ±20 %; Производитель: Coilcraft, Inc.; Отклонение: ±20 %; Номинальное активное сопротивление: 21,35 мОм; Максимальное активное сопротивление: 23,5 мОм; Резонансная частота: 38 МГц; Номинальный ток (при нагреве на 20 °С/40 °С): 6 А; Ток насыщения: 3,5 А; Рабочее напряжение: от 0 В до 20 В; Рабочие температуры: от –40 °С до +125 °С; Корпус: 4,0 x 4,0 x 2,1; Наименование: XFL4020-222MEC; Номинал: 2,2 мкГн; HelpURL: https://www.coilcraft.com/en-us/products/power/shielded-inductors/molded-inductor/xfl/xfl4020/
R6 = r0120: =Описание; ID: r0120; Фамилия: Паньков; Описание: Резистор чип 0603 27 кОм ±1 % 0,1 Вт; Наименование: RC0603FR-0727KL; Производитель: YAGEO Corp.; Отклонение: ±1 %; Номинальное напряжение: 75 В; Номинальный ток: 1 А; Рабочие температуры: от –55 °С до +155 °С; Корпус: 0603; Примечание: Ряд E24; Номинал: 27 к; HelpURL: https://www.yageo.com/upload/media/product/productsearch/datasheet/rchip/PYu-RC_Group_51_RoHS_L_11.pdf
R7 R10 = r0115: =Описание; ID: r0115; Фамилия: Паньков; Описание: Резистор чип 0603 20 кОм ±1 % 0,1 Вт; Наименование: RC0603FR-0720KL; Производитель: YAGEO Corp.; Отклонение: ±1 %; Номинальное напряжение: 75 В; Номинальный ток: 1 А; Рабочие температуры: от –55 °С до +155 °С; Корпус: 0603; Примечание: Ряд E24; Номинал: 20 к; HelpURL: https://www.yageo.com/upload/media/product/productsearch/datasheet/rchip/PYu-RC_Group_51_RoHS_L_11.pdf
R8 = r0141: as R1 on sheet 001_Jetson_Nano; Номинал: 100 к; HelpURL: https://www.yageo.com/upload/media/product/productsearch/datasheet/rchip/PYu-RC_Group_51_RoHS_L_11.pdf
R9 = r0138: =Описание; ID: r0138; Фамилия: Паньков; Описание: Резистор чип 0603 82 кОм ±1 % 0,1 Вт; Наименование: RC0603FR-0782KL; Производитель: YAGEO Corp.; Отклонение: ±1 %; Номинальное напряжение: 75 В; Номинальный ток: 1 А; Рабочие температуры: от –55 °С до +155 °С; Корпус: 0603; Примечание: Ряд E24; Номинал: 82 к; HelpURL: https://www.yageo.com/upload/media/product/productsearch/datasheet/rchip/PYu-RC_Group_51_RoHS_L_11.pdf
R11 = r0170: =Описание; ID: r0170; Фамилия: Паньков; Описание: Резистор чип 0603 750 кОм ±1 % 0,1 Вт; Наименование: RC0603FR-07750KL; Производитель: YAGEO Corp.; Отклонение: ±1 %; Номинальное напряжение: 75 В; Номинальный ток: 1 А; Рабочие температуры: от –55 °С до +155 °С; Корпус: 0603; Примечание: Ряд E24; Номинал: 750 к; HelpURL: https://www.yageo.com/upload/media/product/productsearch/datasheet/rchip/PYu-RC_Group_51_RoHS_L_11.pdf
R12 = r0155: =Описание; ID: r0155; Фамилия: Паньков; Описание: Резистор чип 0603 240 кОм ±1 % 0,1 Вт; Наименование: RC0603FR-07240KL; Производитель: YAGEO Corp.; Отклонение: ±1 %; Номинальное напряжение: 75 В; Номинальный ток: 1 А; Рабочие температуры: от –55 °С до +155 °С; Корпус: 0603; Примечание: Ряд E24; Номинал: 240 к; HelpURL: https://www.yageo.com/upload/media/product/productsearch/datasheet/rchip/PYu-RC_Group_51_RoHS_L_11.pdf
R13 = r0064: =Описание; ID: r0064; Фамилия: Ларионов; Описание: Резистор чип 0603 330 Ом ±1 % 0,1 Вт; Наименование: RC0603FR-07330RL; Производитель: YAGEO Corp.; Отклонение: ±1 %; Номинальное напряжение: 75 В; Номинальный ток: 1 А; Рабочие температуры: от –55 °С до +155 °С; Корпус: 0603; Примечание: Ряд E24; Номинал: 330; HelpURL: https://www.yageo.com/upload/media/product/productsearch/datasheet/rchip/PYu-RC_Group_51_RoHS_L_11.pdf
X5 = x0051: =Описание; Contact_1: GND; Contact_3: +24V; ID: x0051; Фамилия: Шкабара; Описание: Terminal Block 4 pin 3,5 мм; Производитель: Molex; Contact_2: GND; Contact_4: +24V; Наименование: 39502-1004; HelpURL: https://www.molex.com/molex/products/part-detail/terminal_blocks/0395021004

## Sheet 003_Serial_Port.SchDoc: Плата материнская Jetson Nano
size 594 x 420 mm; ApprovedBy: Капустин; CheckedBy: Капустин; DrawnBy: Ларионов; DocumentNumber: СПБПУ.3331506.016Ý3; SheetNumber: 3; SheetTotal: 9; DocumentCode: Ý3; ImagePath: СПБПУ.3331506.016
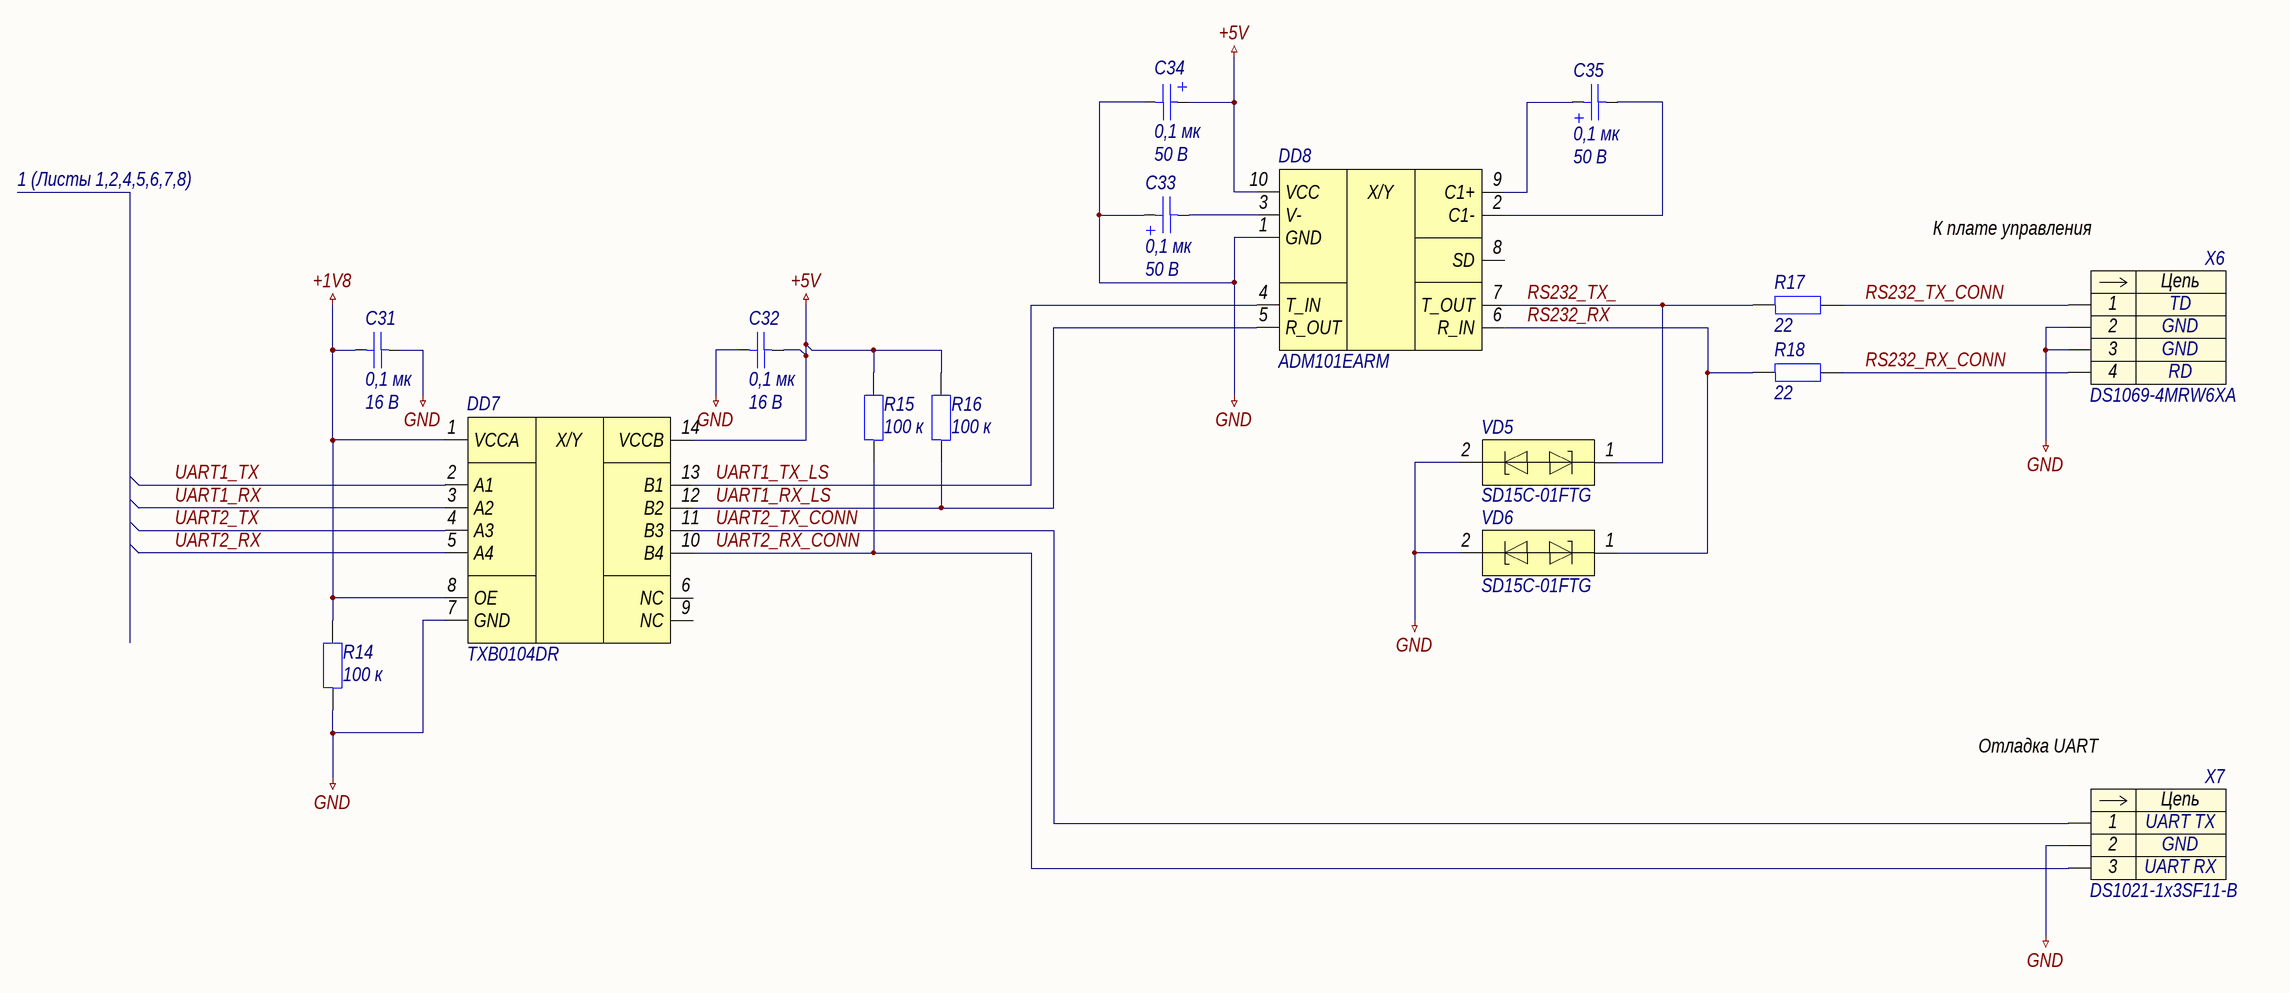
[diagram p2: 003_Serial_Port.SchDoc]

### Parts
C31  0,1 мк  Напряжение: 16 В  [C0603]
C32  0,1 мк  Напряжение: 16 В  [C0603]
C33  0,1 мк  Напряжение: 50 В  [C3216-18]
C34  0,1 мк  Напряжение: 50 В  [C3216-18]
C35  0,1 мк  Напряжение: 50 В  [C3216-18]
DD7  TXB0104DR  [SOIC-14-P127-865X390X175-L84X41]
DD8  ADM101EARM  [MSOP-10-P50-300X300X110-L55X23]
R14  100 к  [R0603]
R15  100 к  [R0603]
R16  100 к  [R0603]
R17  22  [R0603]
R18  22  [R0603]
VD5  SD15C-01FTG  [SOD-323-257X130X114]
VD6  SD15C-01FTG  [SOD-323-257X130X114]
X6  DS1069-4MRW6XA  [DS1069-4MRW6XA]
X7  DS1021-1x3SF11-B  [DS1021-1X3SF11-B]

### Nets
+1V8: C31.1 DD7.1(VCCA) DD7.8(OE) R14.2
+5V: C32.2 C34.1 DD7.14(VCCB) DD8.10(VCC) R15.2 R16.2
GND: C31.2 C32.1 C33.1 C34.2 DD7.7(GND) DD8.1(GND) R14.1 VD5.2 VD6.2 X6.2 X6.3 X7.2
RS232_RX: DD8.6(R_IN) R18.1 VD6.1
RS232_RX_CONN: R18.2 X6.4
RS232_TX_: DD8.7(T_OUT) R17.1 VD5.1
RS232_TX_CONN: R17.2 X6.1
UART1_RX: DD7.3(A2)
UART1_RX_LS: DD7.12(B2) DD8.5(R_OUT) R16.1
UART1_TX: DD7.2(A1)
UART1_TX_LS: DD7.13(B1) DD8.4(T_IN)
UART2_RX: DD7.5(A4)
UART2_RX_CONN: DD7.10(B4) R15.1 X7.3
UART2_TX: DD7.4(A3)
UART2_TX_CONN: DD7.11(B3) X7.1
NetC33_2: C33.2 DD8.3(V-)
NetC35_1: C35.1 DD8.9(C1+)
NetC35_2: C35.2 DD8.2(C1-)

Not connected (* = marked no-connect by the designer): DD7 6(NC) 9(NC); DD8 8(SD)

### Notes on the sheet
- 1 (Листы 1,2,4,5,6,7,8)
- К плате управления STM32F413
- Отладка UART Debug
- Подп. и дата
- Инв. № дубл.
- Взам. инв. №
- Инв. № подл.
- Лист
- Изм.
- № докум.
- Подп.
- Дата
- Копировал
- Формат
- А2
- (in symbol dd0002) X/Y
- (in symbol dd0012) X/Y
- (in symbol x0026) Цепь
- (in symbol x0044) Цепь

### Library data of the parts
C31 C32 = c0081: as C9 on sheet 001_Jetson_Nano; Номинал: 0,1 мк; Номинальное напряжение: 16 В; HelpURL: https://www.yageo.com/upload/media/product/productsearch/datasheet/mlcc/UPY-GPHC_X7R_6.3V-to-50V_20.pdf
C33-C35 = c0001: =Описание; ID: c0001; Фамилия: Ларионов; Описание: Конденсатор танталовый чип 3216-18 100 нФ 50 В ±10 %; Наименование: 293D104X9050A2TE3; Производитель: Vishay Intertechnology, Inc.; Отклонение: ±10 %; Эквивалентное последовательное сопротивление: 19,0 Ом; Среднеквадратичный размах пульсации тока: 0,06 А; Рабочие температуры: от –55 °С до +125 °С; Корпус: 3216-18; Номинал: 0,1 мк; Номинальное напряжение: 50 В; HelpURL: https://www.vishay.com/capacitors/list/product-40002/
DD7 = dd0002: =Описание; ID: dd0002; Фамилия: Ларионов; Описание: Преобразователь логического уровня 3,6 В и 5,5 В 4 линии; Производитель: Texas Instruments Inc.; Входное напряжение: от 1,2 В до 3,6 В; Выходное напряжение: от 1,65 В до 5,5 В; Рабочие температуры: от –40 °С до +85 °С; Корпус: SOIC-14; Наименование: TXB0104DR; HelpURL: https://www.ti.com/product/TXB0104
DD8 = dd0012: =Описание; ID: dd0012; Фамилия: Демчева; Описание: Приемопередатчик RS-232; Производитель: Analog Devices, Inc.; Рабочие температуры: от –40 до +85 °C; Корпус: MSOP-10; Наименование: ADM101EARM; HelpURL: https://www.analog.com/ru/products/adm101e.html
R14-R16 = r0141: as R1 on sheet 001_Jetson_Nano; Номинал: 100 к; HelpURL: https://www.yageo.com/upload/media/product/productsearch/datasheet/rchip/PYu-RC_Group_51_RoHS_L_11.pdf
R17 R18 = r0034: =Описание; ID: r0034; Фамилия: Ларионов; Описание: Резистор чип 0603 22 Ом ±1 % 0,1 Вт; Наименование: RC0603FR-0722RL; Производитель: YAGEO Corp.; Отклонение: ±1 %; Номинальное напряжение: 75 В; Номинальный ток: 1 А; Рабочие температуры: от –55 °С до +155 °С; Корпус: 0603; Примечание: Ряд E24; Номинал: 22; HelpURL: https://www.yageo.com/upload/media/product/productsearch/datasheet/rchip/PYu-RC_Group_51_RoHS_L_11.pdf
VD5 VD6 = vd0006: =Описание; ID: vd0006; Фамилия: Ларионов; Описание: Двунаправленная диодная сборка для подавления помех 15 В; Производитель: Littelfuse, Inc.; Корпус: SOD-323; Наименование: SD15C-01FTG; HelpURL: https://www.littelfuse.com/products/tvs-diode-arrays/general-purpose-esd-protection/sdc/sd15c_01ftg.aspx
X6 = x0044: =Описание; Contact_1: TD; Contact_2: GND; Contact_4: RD; ID: x0044; Фамилия: Паньков; Описание: CWF 4 pin Type A 2,5 мм вилка угловой; Производитель: Connfly Electronic Co., Ltd.; Contact_3: GND; Наименование: DS1069-4MRW6XA; HelpURL: http://en.connfly.group/product/xVkr=EusQssAN0gN=Aos=mU+UrVkR9kqEAN0gN0MUR+g+NB+A
X7 = x0026: =Описание; Contact_1: UART TX; Contact_2: GND; Contact_3: UART RX; ID: x0026; Фамилия: Паньков; Описание: PLS 3 pin 2,54 мм вилка прямой; Производитель: Connfly Electronic Co., Ltd.; Наименование: DS1021-1x3SF11-B; HelpURL: http://en.connfly.group/product/xVkr=EusQssAN0gN=Aos=mU+UrVkR9kqEAN0gN9g+WqANB+A

## Sheet 004_USB.SchDoc: Плата материнская Jetson Nano
size 594 x 420 mm; ApprovedBy: Капустин; CheckedBy: Капустин; DrawnBy: Ларионов; DocumentNumber: СПБПУ.3331506.016Ý3; SheetNumber: 4; SheetTotal: 9; DocumentCode: Ý3; ImagePath: СПБПУ.3331506.016
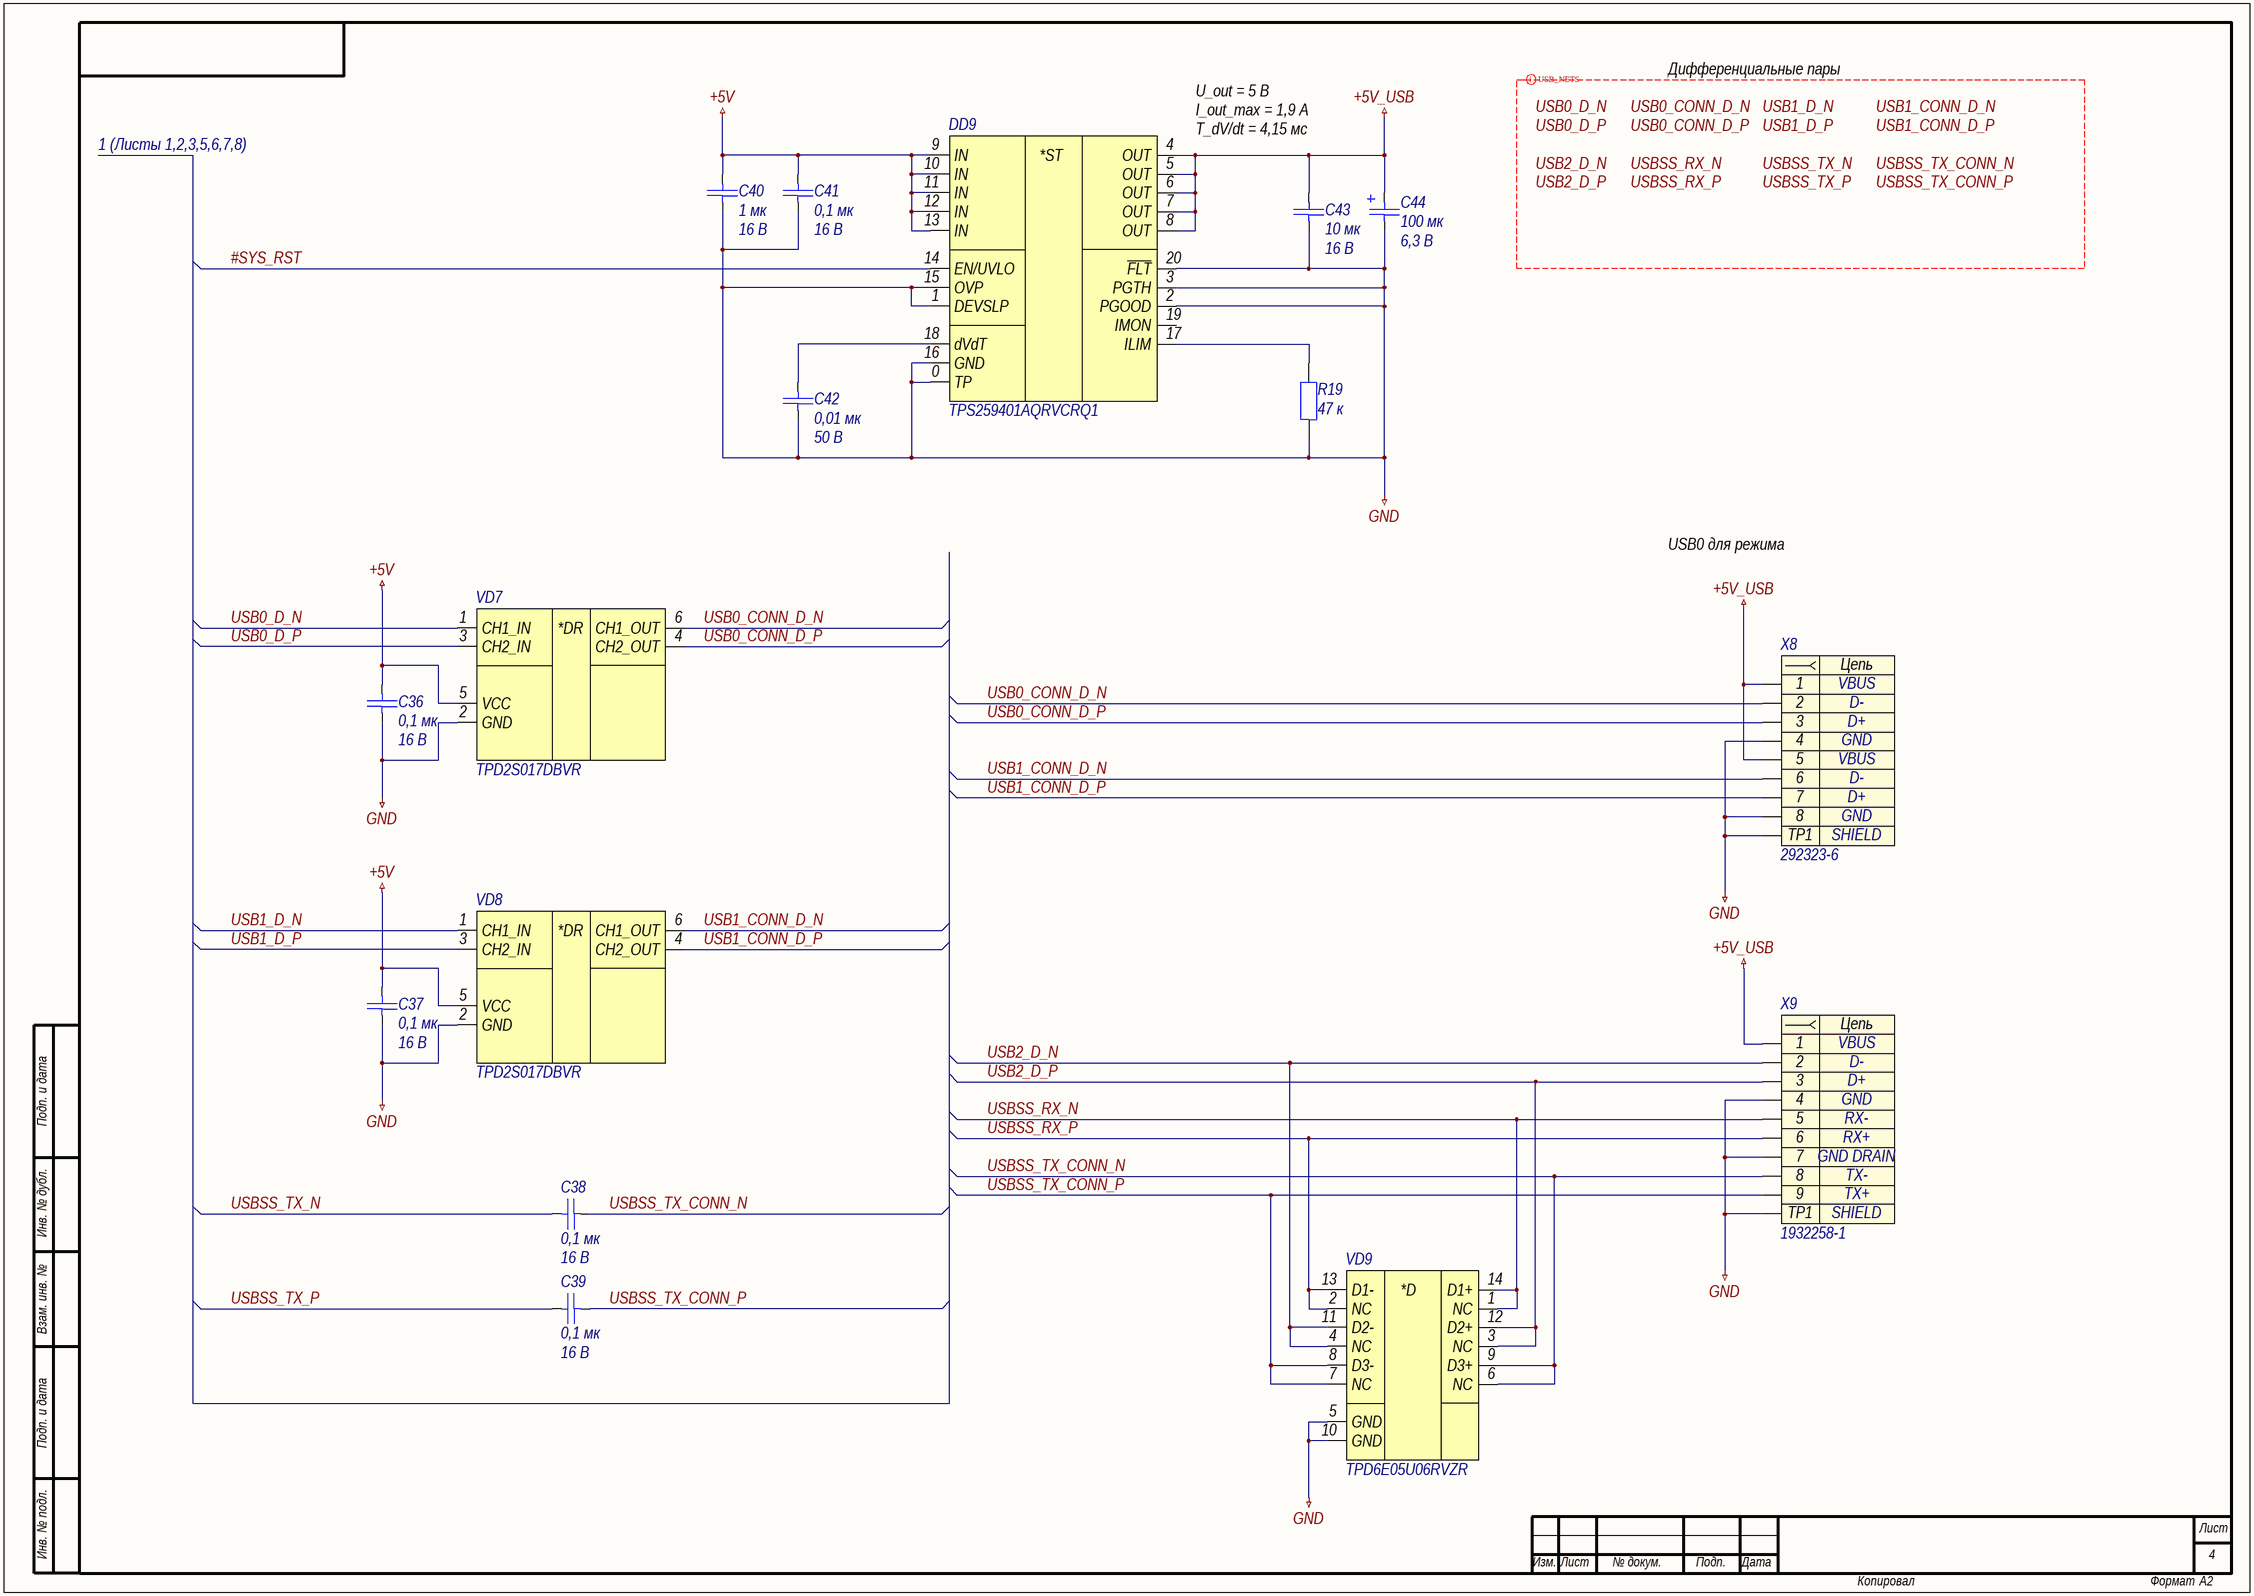
[diagram p3: 004_USB.SchDoc]

### Parts
C36  0,1 мк  Напряжение: 16 В  [C0603]
C37  0,1 мк  Напряжение: 16 В  [C0603]
C38  0,1 мк  Напряжение: 16 В  [C0603]
C39  0,1 мк  Напряжение: 16 В  [C0603]
C40  1 мк  Напряжение: 16 В  [C0603]
C41  0,1 мк  Напряжение: 16 В  [C0603]
C42  0,01 мк  Напряжение: 50 В  [C0603]
C43  10 мк  Напряжение: 16 В  [C0603]
C44  100 мк  Напряжение: 6,3 В  [C7343-20]
DD9  TPS259401AQRVCRQ1  [WQFN-20-P50-300X400X80-L40X20-T270X170]
R19  47 к  [R0603]
VD7  TPD2S017DBVR  [SOT-23-6-P95-290X280X145]
VD8  TPD2S017DBVR  [SOT-23-6-P95-290X280X145]
VD9  TPD6E05U06RVZR  [USON-14-P50-350X135X55-L30X20]
X8  292323-6  [292323-6]
X9  1932258-1  [1932258-1]

### Nets
+5V: C36.1 C37.1 C40.1 C41.1 DD9.9(IN) DD9.10(IN) DD9.11(IN) DD9.12(IN) DD9.13(IN) VD7.5(VCC) VD8.5(VCC)
+5V_USB: C43.1 C44.1 DD9.4(OUT) DD9.5(OUT) DD9.6(OUT) DD9.7(OUT) DD9.8(OUT) X8.1 X8.5 X9.1
GND: C36.2 C37.2 C40.2 C41.2 C42.2 C43.2 C44.2 DD9.0(TP) DD9.1(DEVSLP) DD9.2(PGOOD) DD9.3(PGTH) DD9.15(OVP) DD9.16(GND) DD9.20(~{FLT}) R19.1 VD7.2(GND) VD8.2(GND) VD9.5(GND) VD9.10(GND) X8.4 X8.8 X8.TP1 X9.4 X9.7 X9.TP1
#SYS_RST: DD9.14(EN/UVLO)
USB0_CONN_D_N: VD7.6(CH1_OUT) X8.2
USB0_CONN_D_P: VD7.4(CH2_OUT) X8.3
USB0_D_N: VD7.1(CH1_IN)
USB0_D_P: VD7.3(CH2_IN)
USB1_CONN_D_N: VD8.6(CH1_OUT) X8.6
USB1_CONN_D_P: VD8.4(CH2_OUT) X8.7
USB1_D_N: VD8.1(CH1_IN)
USB1_D_P: VD8.3(CH2_IN)
USB2_D_N: VD9.4(NC) VD9.11(D2-) X9.2
USB2_D_P: VD9.3(NC) VD9.12(D2+) X9.3
USBSS_RX_N: VD9.1(NC) VD9.14(D1+) X9.5
USBSS_RX_P: VD9.2(NC) VD9.13(D1-) X9.6
USBSS_TX_CONN_N: C38.2 VD9.6(NC) VD9.9(D3+) X9.8
USBSS_TX_CONN_P: C39.2 VD9.7(NC) VD9.8(D3-) X9.9
USBSS_TX_N: C38.1
USBSS_TX_P: C39.1
NetC42_1: C42.1 DD9.18(dVdT)
NetDD9_17: DD9.17(ILIM) R19.2

Not connected (* = marked no-connect by the designer): DD9 19(IMON)

### Layout directives
differential pair; rule Differential Pairs Routing [Pref Gap = 0.3mm    Min Gap  = 0.15mm    Max Gap  = 0.3mmPref Width = 0.126mm    Min Width  = 0.126mm    Max Width  = 0.155mm]; differential pair class USB_SIGNALS: USB0_CONN_D_N, USB0_CONN_D_P, USB0_D_N, USB0_D_P, USB1_CONN_D_N, USB1_CONN_D_P, USB1_D_N, USB1_D_P, USB2_D_N, USB2_D_P, USBSS_RX_N, USBSS_RX_P, USBSS_TX_CONN_N, USBSS_TX_CONN_P, USBSS_TX_N, USBSS_TX_P

### Notes on the sheet
- Дифференциальные пары
- 1 (Листы 1,2,3,5,6,7,8)
- U_out = 5 В
  I_out_max = 1,9 А
  T_dV/dt = 4,15 мс
- USB0 для режима восстановления
- Labels drawn without touching a wire or pin: USB0_CONN_D_N, USB0_CONN_D_P, USB0_D_N, USB0_D_P, USB1_CONN_D_N, USB1_CONN_D_P, USB1_D_N, USB1_D_P, USB2_D_N, USB2_D_P, USBSS_RX_N, USBSS_RX_P, USBSS_TX_CONN_N, USBSS_TX_CONN_P, USBSS_TX_N, USBSS_TX_P
- Подп. и дата
- Инв. № дубл.
- Взам. инв. №
- Инв. № подл.
- Лист
- Изм.
- № докум.
- Подп.
- Дата
- Копировал
- Формат
- А2
- (in symbol dd0004) *ST
- (in symbol vd0016) *DR
- (in symbol vd0018) *D
- (in symbol x0004) Цепь
- (in symbol x0005) Цепь

### Library data of the parts
C36-C39 C41 = c0081: as C9 on sheet 001_Jetson_Nano; Номинал: 0,1 мк; Номинальное напряжение: 16 В; HelpURL: https://www.yageo.com/upload/media/product/productsearch/datasheet/mlcc/UPY-GPHC_X7R_6.3V-to-50V_20.pdf
C40 = c0113: as C4 on sheet 001_Jetson_Nano; Номинал: 1 мк; Номинальное напряжение: 16 В; HelpURL: https://www.yageo.com/upload/media/product/productsearch/datasheet/mlcc/UPY-GPHC_X7R_6.3V-to-50V_20.pdf
C42 = c0056: as C23 on sheet 002_Buck_Converter; Номинал: 0,01 мк; Номинальное напряжение: 50 В; HelpURL: https://www.yageo.com/upload/media/product/productsearch/datasheet/mlcc/UPY-GPHC_X7R_6.3V-to-50V_20.pdf
C43 = c0145: as C14 on sheet 002_Buck_Converter; Номинал: 10 мк; Номинальное напряжение: 16 В; HelpURL: https://www.yageo.com/upload/media/product/productsearch/datasheet/mlcc/UPY-GPHC_X5R_4V-to-50V_26.pdf
C44 = c0170: =Описание; ID: c0170; Фамилия: Ларионов; Описание: Конденсатор электролитический чип 7343-20 100 мкФ 6,3 В ±20 %; Наименование: ECASD40J107M015K00; Производитель: Murata Manufacturing Co., Ltd.; Отклонение: ±20 %; Эквивалентное последовательное сопротивление: 0,015 Ом; Среднеквадратичный размах пульсации тока: 2 А; Рабочие температуры: от –40 °С до +105 °С; Корпус: 7343-20; Номинал: 100 мк; Номинальное напряжение: 6,3 В; HelpURL: https://www.murata.com/en-us/products/productdetail?partno=ECASD40J107M015K00
DD9 = dd0004: =Описание; ID: dd0004; Фамилия: Ларионов; Описание: Защитная микросхема eFuse 18 В и 5,3 А; Производитель: Texas Instruments Inc.; Напряжение: от 2,7 В до 18 В; Максимальное напряжение: 20 В; Ток: от 0,6 А до 5,3 А; Рабочие температуры: от –40 °С до +125 °С; Корпус: WQFN-20; Наименование: TPS259401AQRVCRQ1; HelpURL: https://www.ti.com/product/TPS25940-Q1
R19 = r0129: =Описание; ID: r0129; Фамилия: Паньков; Описание: Резистор чип 0603 47 кОм ±1 % 0,1 Вт; Наименование: RC0603FR-0747KL; Производитель: YAGEO Corp.; Отклонение: ±1 %; Номинальное напряжение: 75 В; Номинальный ток: 1 А; Рабочие температуры: от –55 °С до +155 °С; Корпус: 0603; Примечание: Ряд E24; Номинал: 47 к; HelpURL: https://www.yageo.com/upload/media/product/productsearch/datasheet/rchip/PYu-RC_Group_51_RoHS_L_11.pdf
VD7 VD8 = vd0016: =Описание; ID: vd0016; Фамилия: Паньков; Описание: Диодная сборка для подавления помех 5 В; Производитель: Texas Instruments Inc.; Корпус: SOT-23-6; Наименование: TPD2S017DBVR; HelpURL: https://www.ti.com/product/TPD2S017
VD9 = vd0018: =Описание; ID: vd0018; Фамилия: Ларионов; Описание: Диодная сборка для подавления помех 5,5 В; Производитель: Texas Instruments Inc.; Корпус: USON-14; Наименование: TPD6E05U06RVZR; HelpURL: https://www.ti.com/product/TPD6E05U06
X8 = x0004: =Описание; Contact_1: VBUS; Contact_2: D-; Contact_3: D+; Contact_4: GND; TP1: SHIELD; ID: x0004; Фамилия: Ларионов; Описание: USB 2.0 Type A x2 гнездо угловой; Производитель: TE Connectivity; Contact_5: VBUS; Contact_6: D-; Contact_7: D+; Contact_8: GND; Наименование: 292323-6; HelpURL: https://www.te.com/usa-en/product-292323-6.html
X9 = x0005: =Описание; Contact_1: VBUS; Contact_2: D-; Contact_3: D+; Contact_4: GND; Contact_5: RX-; Contact_6: RX+; Contact_7: GND DRAIN; Contact_8: TX-; Contact_9: TX+; TP1: SHIELD; ID: x0005; Фамилия: Ларионов; Описание: USB 3.0 Type A гнездо угловой; Производитель: TE Connectivity; Наименование: 1932258-1; HelpURL: https://www.te.com/usa-en/product-1932258-1.html

## Sheet 005_DP.SchDoc: Плата материнская Jetson Nano
size 891 x 420 mm; ApprovedBy: Капустин; CheckedBy: Капустин; DrawnBy: Ларионов; DocumentNumber: СПБПУ.3331506.016Ý3; SheetNumber: 5; SheetTotal: 9; DocumentCode: Ý3; ImagePath: СПБПУ.3331506.016
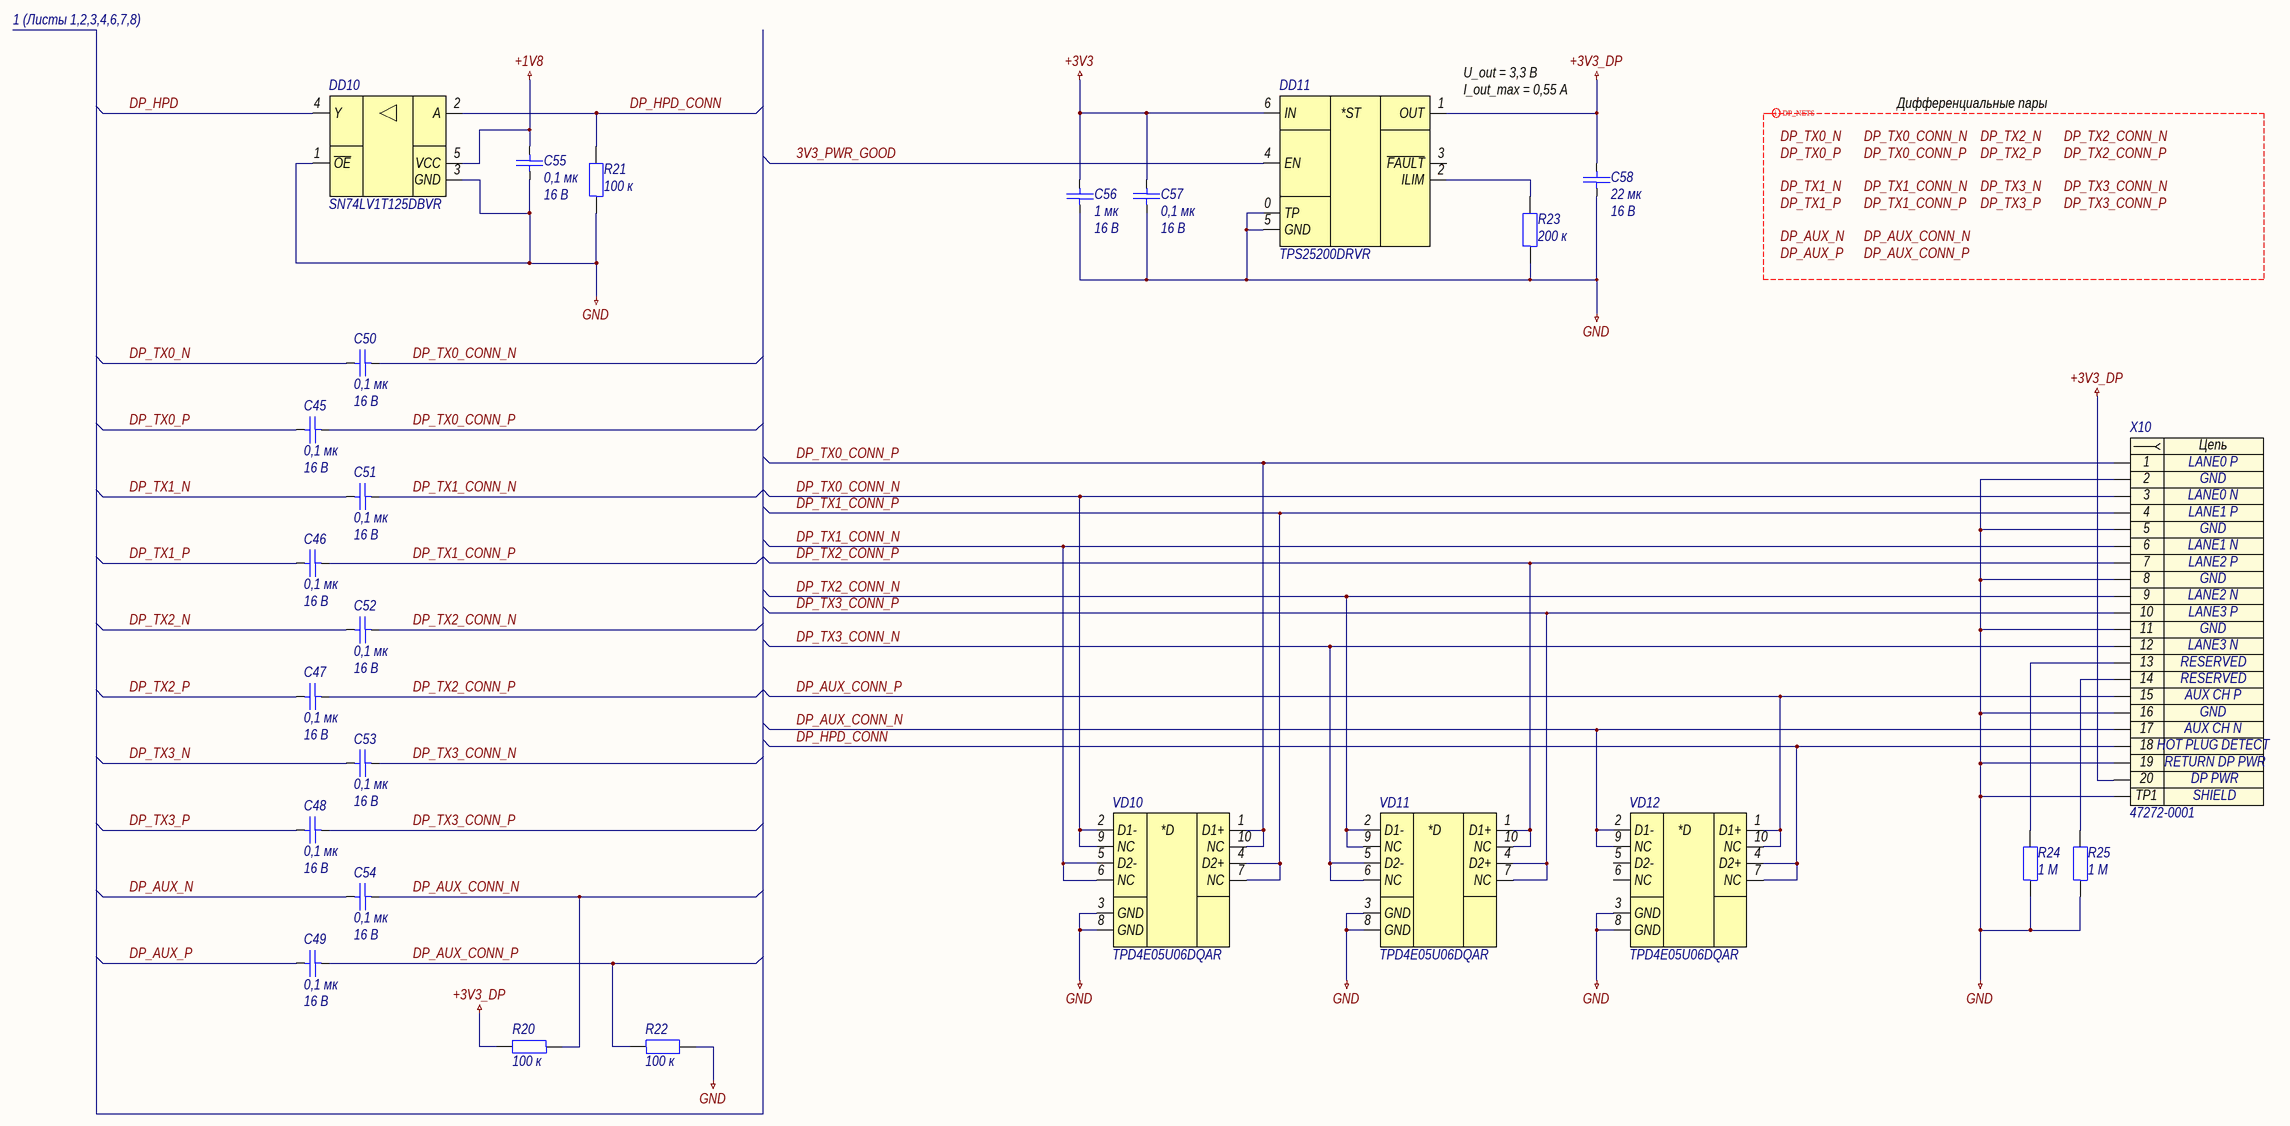
[diagram p4: 005_DP.SchDoc]

### Parts
C45  0,1 мк  Напряжение: 16 В  [C0603]
C46  0,1 мк  Напряжение: 16 В  [C0603]
C47  0,1 мк  Напряжение: 16 В  [C0603]
C48  0,1 мк  Напряжение: 16 В  [C0603]
C49  0,1 мк  Напряжение: 16 В  [C0603]
C50  0,1 мк  Напряжение: 16 В  [C0603]
C51  0,1 мк  Напряжение: 16 В  [C0603]
C52  0,1 мк  Напряжение: 16 В  [C0603]
C53  0,1 мк  Напряжение: 16 В  [C0603]
C54  0,1 мк  Напряжение: 16 В  [C0603]
C55  0,1 мк  Напряжение: 16 В  [C0603]
C56  1 мк  Напряжение: 16 В  [C0603]
C57  0,1 мк  Напряжение: 16 В  [C0603]
C58  22 мк  Напряжение: 16 В  [C0805]
DD10  SN74LV1T125DBVR  [SOT-23-5-P95-290X280X145]
DD11  TPS25200DRVR  [WSON-6-P65-200X200X80-L30X25-T170X110]
R20  100 к  [R0603]
R21  100 к  [R0603]
R22  100 к  [R0603]
R23  200 к  [R0603]
R24  1 М  [R0603]
R25  1 М  [R0603]
VD10  TPD4E05U06DQAR  [USON-10-P50-250X100X55-L36X20]
VD11  TPD4E05U06DQAR  [USON-10-P50-250X100X55-L36X20]
VD12  TPD4E05U06DQAR  [USON-10-P50-250X100X55-L36X20]
X10  47272-0001  [47272-0001]

### Nets
+1V8: C55.2 DD10.5(VCC)
+3V3: C56.1 C57.2 DD11.6(IN)
+3V3_DP: C58.1 DD11.1(OUT) R20.2 X10.20
GND: C55.1 C56.2 C57.1 C58.2 DD10.1(~{OE}) DD10.3(GND) DD11.0(TP) DD11.5(GND) R21.1 R22.2 R23.1 R24.1 R25.1 VD10.3(GND) VD10.8(GND) VD11.3(GND) VD11.8(GND) VD12.3(GND) VD12.8(GND) X10.2 X10.5 X10.8 X10.11 X10.16 X10.19 X10.TP1
3V3_PWR_GOOD: DD11.4(EN)
DP_AUX_CONN_N: C54.2 R20.1 VD12.2(D1-) VD12.9(NC) X10.17
DP_AUX_CONN_P: C49.2 R22.1 VD12.1(D1+) VD12.10(NC) X10.15
DP_AUX_N: C54.1
DP_AUX_P: C49.1
DP_HPD: DD10.4(Y)
DP_HPD_CONN: DD10.2(A) R21.2 VD12.4(D2+) VD12.7(NC) X10.18
DP_TX0_CONN_N: C50.2 VD10.2(D1-) VD10.9(NC) X10.3
DP_TX0_CONN_P: C45.2 VD10.1(D1+) VD10.10(NC) X10.1
DP_TX0_N: C50.1
DP_TX0_P: C45.1
DP_TX1_CONN_N: C51.2 VD10.5(D2-) VD10.6(NC) X10.6
DP_TX1_CONN_P: C46.2 VD10.4(D2+) VD10.7(NC) X10.4
DP_TX1_N: C51.1
DP_TX1_P: C46.1
DP_TX2_CONN_N: C52.2 VD11.2(D1-) VD11.9(NC) X10.9
DP_TX2_CONN_P: C47.2 VD11.1(D1+) VD11.10(NC) X10.7
DP_TX2_N: C52.1
DP_TX2_P: C47.1
DP_TX3_CONN_N: C53.2 VD11.5(D2-) VD11.6(NC) X10.12
DP_TX3_CONN_P: C48.2 VD11.4(D2+) VD11.7(NC) X10.10
DP_TX3_N: C53.1
DP_TX3_P: C48.1
NetDD11_2: DD11.2(ILIM) R23.2
NetR24_2: R24.2 X10.13
NetR25_2: R25.2 X10.14

Not connected (* = marked no-connect by the designer): DD11 3(~{FAULT}); VD12 5(D2-) 6(NC)

### Layout directives
differential pair; rule Differential Pairs Routing [Pref Gap = 0.3mm    Min Gap  = 0.15mm    Max Gap  = 0.3mmPref Width = 0.126mm    Min Width  = 0.126mm    Max Width  = 0.155mm]; differential pair class DP_SIGNALS: DP_AUX_CONN_N, DP_AUX_CONN_P, DP_AUX_N, DP_AUX_P, DP_TX0_CONN_N, DP_TX0_CONN_P, DP_TX0_N, DP_TX0_P, DP_TX1_CONN_N, DP_TX1_CONN_P, DP_TX1_N, DP_TX1_P, DP_TX2_CONN_N, DP_TX2_CONN_P, DP_TX2_N, DP_TX2_P, DP_TX3_CONN_N, DP_TX3_CONN_P, DP_TX3_N, DP_TX3_P

### Notes on the sheet
- 1 (Листы 1,2,3,4,6,7,8)
- U_out = 3,3 В
  I_out_max = 0,55 А
- Дифференциальные пары
- Labels drawn without touching a wire or pin: DP_AUX_CONN_N, DP_AUX_CONN_P, DP_AUX_N, DP_AUX_P, DP_TX0_CONN_N, DP_TX0_CONN_P, DP_TX0_N, DP_TX0_P, DP_TX1_CONN_N, DP_TX1_CONN_P, DP_TX1_N, DP_TX1_P, DP_TX2_CONN_N, DP_TX2_CONN_P, DP_TX2_N, DP_TX2_P, DP_TX3_CONN_N, DP_TX3_CONN_P, DP_TX3_N, DP_TX3_P
- Подп. и дата
- Инв. № дубл.
- Взам. инв. №
- Инв. № подл.
- Лист
- Изм.
- № докум.
- Подп.
- Дата
- Копировал
- Формат
- А3х3
- (in symbol dd0002) *ST
- (in symbol vd0017) *D
- (in symbol x0053) Цепь

### Library data of the parts
C45-C55 C57 = c0081: as C9 on sheet 001_Jetson_Nano; Номинал: 0,1 мк; Номинальное напряжение: 16 В; HelpURL: https://www.yageo.com/upload/media/product/productsearch/datasheet/mlcc/UPY-GPHC_X7R_6.3V-to-50V_20.pdf
C56 = c0113: as C4 on sheet 001_Jetson_Nano; Номинал: 1 мк; Номинальное напряжение: 16 В; HelpURL: https://www.yageo.com/upload/media/product/productsearch/datasheet/mlcc/UPY-GPHC_X7R_6.3V-to-50V_20.pdf
C58 = c0159: as C25 on sheet 002_Buck_Converter; Номинал: 22 мк; Номинальное напряжение: 16 В; HelpURL: https://www.yageo.com/upload/media/product/productsearch/datasheet/mlcc/UPY-GPHC_X5R_4V-to-50V_26.pdf
DD10 = dd0003: =Описание; ID: dd0003; Фамилия: Ларионов; Описание: Буферная микросхема 1 линия 3 состояния выхода; Производитель: Texas Instruments Inc.; Корпус: SOT-23-5; Наименование: SN74LV1T125DBVR; HelpURL: https://www.ti.com/product/SN74LV1T125
DD11 = dd0002: =Описание; ID: dd0002; Фамилия: Ларионов; Описание: Защитная микросхема eFuse 6,5 В и 2,9 А; Производитель: Texas Instruments Inc.; Напряжение: от 2,5 В до 6,5 В; Максимальное напряжение: 20 В; Ток: от 0,085 А до 2,9 А; Рабочие температуры: от –40 °С до +125 °С; Корпус: WSON-6; Наименование: TPS25200DRVR; HelpURL: https://www.ti.com/product/TPS25200
R20-R22 = r0141: as R1 on sheet 001_Jetson_Nano; Номинал: 100 к; HelpURL: https://www.yageo.com/upload/media/product/productsearch/datasheet/rchip/PYu-RC_Group_51_RoHS_L_11.pdf
R23 = r0153: =Описание; ID: r0153; Фамилия: Паньков; Описание: Резистор чип 0603 200 кОм ±1 % 0,1 Вт; Наименование: RC0603FR-07200KL; Производитель: YAGEO Corp.; Отклонение: ±1 %; Номинальное напряжение: 75 В; Номинальный ток: 1 А; Рабочие температуры: от –55 °С до +155 °С; Корпус: 0603; Примечание: Ряд E24; Номинал: 200 к; HelpURL: https://www.yageo.com/upload/media/product/productsearch/datasheet/rchip/PYu-RC_Group_51_RoHS_L_11.pdf
R24 R25 = r0173: =Описание; ID: r0173; Фамилия: Ляпцев; Описание: Резистор чип 0603 1 МОм ±1 % 0,1 Вт; Наименование: RC0603FR-071ML; Производитель: YAGEO Corp.; Отклонение: ±1 %; Номинальное напряжение: 75 В; Номинальный ток: 1 А; Рабочие температуры: от –55 °С до +155 °С; Корпус: 0603; Примечание: Ряд E24; Номинал: 1 М; HelpURL: https://www.yageo.com/upload/media/product/productsearch/datasheet/rchip/PYu-RC_Group_51_RoHS_L_11.pdf
VD10-VD12 = vd0017: =Описание; ID: vd0017; Фамилия: Ларионов; Описание: Диодная сборка для подавления помех 5,5 В; Производитель: Texas Instruments Inc.; Корпус: USON-10; Наименование: TPD4E05U06DQAR; HelpURL: https://www.ti.com/product/TPD4E05U06
X10 = x0053: =Описание; Contact_1: LANE0 P; Contact_2: GND; Contact_3: LANE0 N; Contact_4: LANE1 P; Contact_6: LANE1 N; Contact_7: LANE2 P; Contact_9: LANE2 N; Contact_10: LANE3 P; Contact_12: LANE3 N; Contact_13: RESERVED; Contact_15: AUX CH P; Contact_17: AUX CH N; Contact_18: HOT PLUG DETECT; Contact_19: RETURN DP PWR; TP1: SHIELD; Contact_20: DP PWR; ID: x0053; Фамилия: Ларионов; Описание: DisplayPort гнездо угловой; Производитель: Molex; Contact_5: GND; Contact_8: GND; Contact_11: GND; Contact_14: RESERVED; Contact_16: GND; Наименование: 47272-0001; HelpURL: https://www.molex.com/molex/products/part-detail/io_connectors/0472720001